# Altium project S7CAS-PLEIADES-CARTE-FILLE_P02.PrjPcb (part 1 of 2)
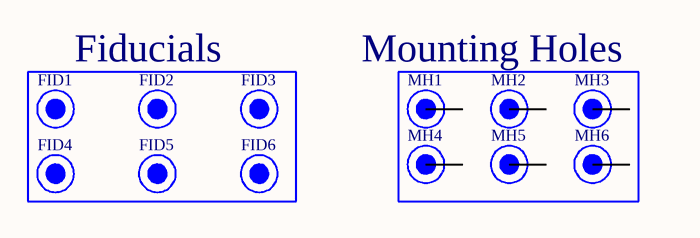
[diagram p0: S7CAS-PLEIADES-CARTE-FILLE_P02_TITLE_SHEET.SchDoc]
Project_Date: 2019-01-09; Project_DateCode: DC1234; Project_Designer1: Thomas Roy; Project_Designer2: Jean-Francois Bilodeau; Project_Designer3: Simon Milhomme; Project_Designer4: Emile Laplante; Project_Global: S7CAS-PLEIADES; Project_Group: CARTE-FILLE; Project_Name: CARTE-FILLE; Project_Revision: 1.000; Project_Stencil_Bot_Thickness: 0.1 MM; Project_Stencil_Top_Thickness: 0.1 MM
5 sheets, 168 parts. Net scope: flat (ports and power ports of the same name join across sheets).
Board file: S7CAS-PLEIADES-CARTE-FILLE_P02.PcbDoc
Sheets:
  S7CAS-PLEIADES-CARTE-FILLE_P02_TITLE_SHEET.SchDoc
  S7CAS-PLEIADES-CARTE-FILLE_P02_ALIMENTATION.SchDoc
  S7CAS-PLEIADES-CARTE-FILLE_P02_CONNECTEUR_FMC.SchDoc
  S7CAS-PLEIADES-CARTE-FILLE_P02_ADC.SchDoc
  S7CAS-PLEIADES-CARTE-FILLE_P02_DAC.SchDoc

## Sheet S7CAS-PLEIADES-CARTE-FILLE_P02_TITLE_SHEET.SchDoc
size Tabloid; DocumentNumber: 1; SheetNumber: 1; SheetTotal: 5; Size: 11x17; Sheet_Name: Sheet Description

### Parts
FID1  Fiducial 1mm  [FID_1MM]  (value not drawn)  (no BOM)
FID2  Fiducial 1mm  [FID_1MM]  (value not drawn)  (no BOM)
FID3  Fiducial 1mm  [FID_1MM]  (value not drawn)  (no BOM)
FID4  Fiducial 1mm  [FID_1MM]  (value not drawn)  (no BOM)
FID5  Fiducial 1mm  [FID_1MM]  (value not drawn)  (no BOM)
FID6  Fiducial 1mm  [FID_1MM]  (value not drawn)  (no BOM)
MH1  Mounting Hole 6-32  [MH_ENG_6-32]  (value not drawn)  (no BOM)
MH2  Mounting Hole 6-32  [MH_ENG_6-32]  (value not drawn)  (no BOM)
MH3  Mounting Hole 6-32  [MH_ENG_6-32]  (value not drawn)  (no BOM)
MH4  Mounting Hole 6-32  [MH_ENG_6-32]  (value not drawn)  (no BOM)
MH5  Mounting Hole 6-32  [MH_ENG_6-32]  (value not drawn)  (no BOM)
MH6  Mounting Hole 6-32  [MH_ENG_6-32]  (value not drawn)  (no BOM)

### Blocks framed on the sheet
Fiducials: FID1-FID6

### Nets

Not connected (* = marked no-connect by the designer): MH1 1; MH2 1; MH3 1; MH4 1; MH5 1; MH6 1

### Notes on the sheet
- Mounting Holes
- Revision history
- Package size conversion
- Metric
- 1005
- 1608
- Imperial
- 0402
- 0603
- Revision
- 2012
- 3216
- 0805
- 1206
- 3225
- 6432
- 1210
- 2512
- Date :
- Project Title
- Global Project
- Size
- Group
- Date
- Sheet
- of
- Filename
- Designers

### Library data of the parts
FID1-FID6 = FID_1MM: FID - 1MM; Current: *; Mfg Part Number: *; HelpURL: *; CreatedBy: Jonathan Bouchard; VerifiedBy: Alexandre Imbeault; FootprintNameOK: Jonathan Bouchard; Temperature: *; Power: *; Precision: *; Value: *; Mfg: *; Package: *; Voltage: *
MH1-MH6 = MH_6-32: MH - Mounting Hole 6-32; Current: *; Mfg Part Number: *; HelpURL: *; CreatedBy: Jonathan Bouchard; VerifiedBy: Alexandre Imbeault; FootprintNameOK: Jonathan Bouchard; Temperature: *; Power: *; Precision: *; Value: *; Mfg: *; Package: *; Voltage: *

## Sheet S7CAS-PLEIADES-CARTE-FILLE_P02_ALIMENTATION.SchDoc
size Tabloid; DocumentNumber: 2; SheetNumber: 2; SheetTotal: 5; Size: 11x17; Sheet_Name: ALIMENTATION
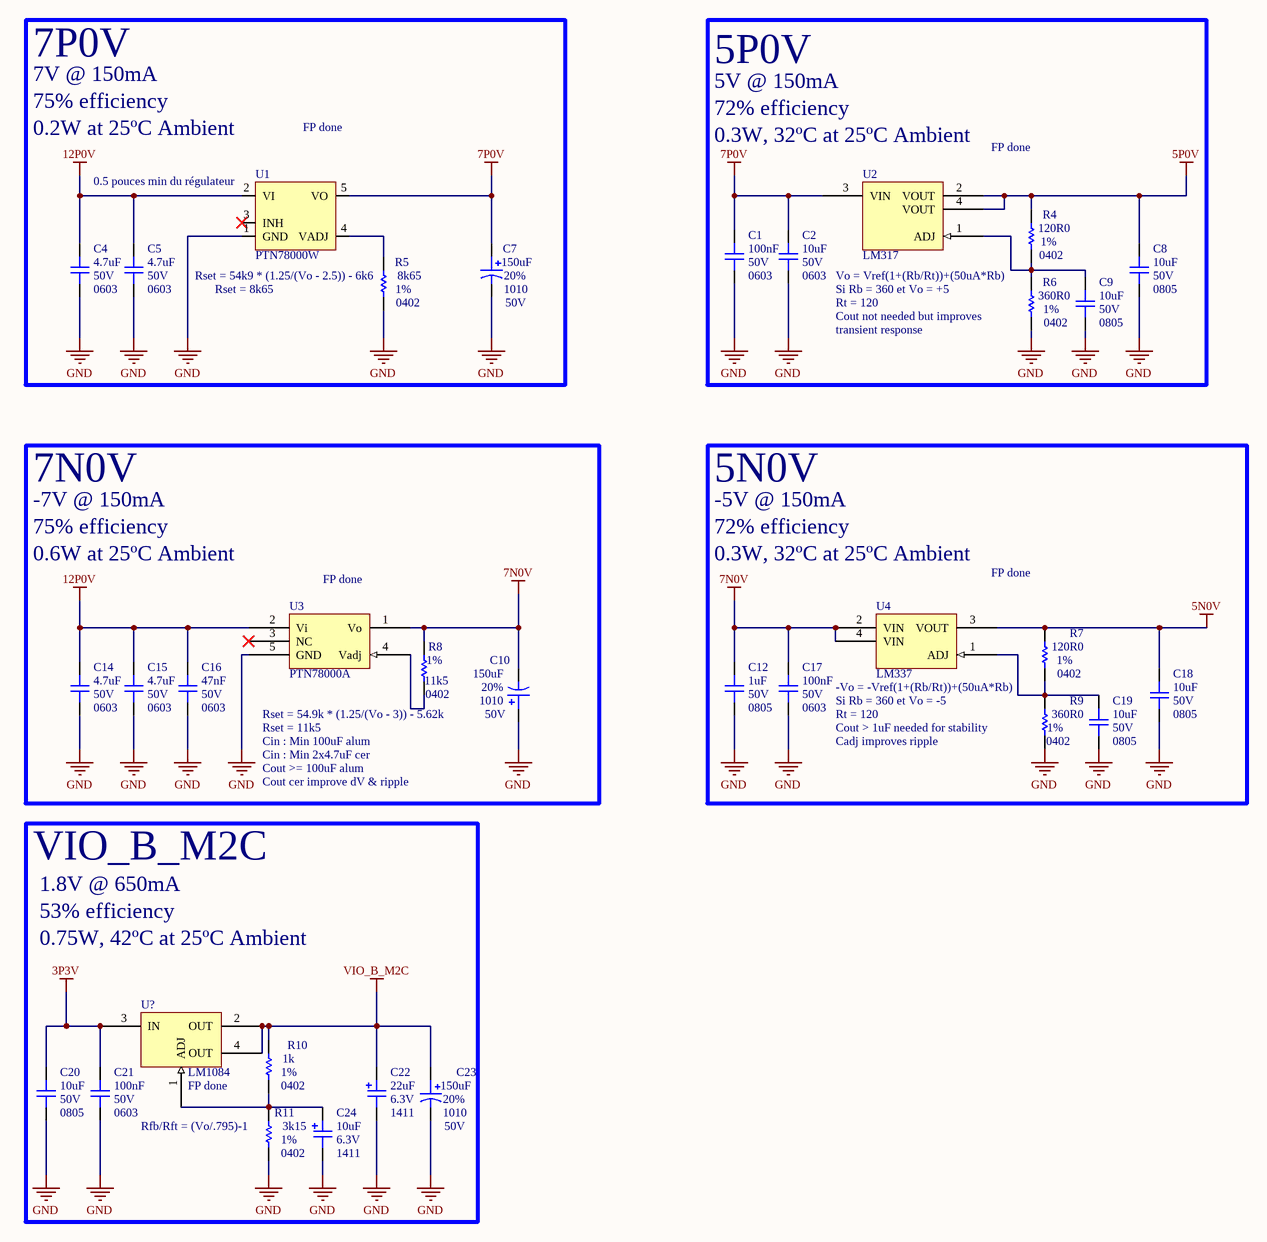
[diagram p1: S7CAS-PLEIADES-CARTE-FILLE_P02_ALIMENTATION.SchDoc]

### Parts
C1  value 100nF  Voltage: 50V  Package: 0603  [CAP_0603]  (hidden comment: CAP - 0603)
C2  value 10uF  Voltage: 50V  Package: 0603  [CAP_0603]  (hidden comment: CAP - 0603)
C4  value 4.7uF  Voltage: 50V  Package: 0603  [CAP_0603]  (hidden comment: CAP - 0603)
C5  value 4.7uF  Voltage: 50V  Package: 0603  [CAP_0603]  (hidden comment: CAP - 0603)
C7  value 150uF  Voltage: 50V  Package: 1010  Precision: 20%  [CAP_ALU_1010_vishay]  (hidden comment: MAL215099101E3)
C8  value 10uF  Voltage: 50V  Package: 0805  [CAP_0805]  (hidden comment: CAP - 0805)
C9  value 10uF  Voltage: 50V  Package: 0805  [CAP_0805]  (hidden comment: CAP - 0805)
C10  value 150uF  Voltage: 50V  Package: 1010  Precision: 20%  [CAP_ALU_1010_vishay]  (hidden comment: MAL215099101E3)
C12  value 1uF  Voltage: 50V  Package: 0805  [CAP_0805]  (hidden comment: CAP - 0805)
C14  value 4.7uF  Voltage: 50V  Package: 0603  [CAP_0603]  (hidden comment: CAP - 0603)
C15  value 4.7uF  Voltage: 50V  Package: 0603  [CAP_0603]  (hidden comment: CAP - 0603)
C16  value 47nF  Voltage: 50V  Package: 0603  [CAP_0603]  (hidden comment: CAP - 0603)
C17  value 100nF  Voltage: 50V  Package: 0603  [CAP_0603]  (hidden comment: CAP - 0603)
C18  value 10uF  Voltage: 50V  Package: 0805  [CAP_0805]  (hidden comment: CAP - 0805)
C19  value 10uF  Voltage: 50V  Package: 0805  [CAP_0805]  (hidden comment: CAP - 0805)
C20  value 10uF  Voltage: 50V  Package: 0805  [CAP_0805]  (hidden comment: CAP - 0805)
C21  value 100nF  Voltage: 50V  Package: 0603  [CAP_0603]  (hidden comment: CAP - 0603)
C22  value 22uF  Voltage: 6.3V  Package: 1411  [CAP_TAN_1411(B)]  (hidden comment: CAP - TANTALUM - CASE B)
C23  value 150uF  Voltage: 50V  Package: 1010  Precision: 20%  [CAP_ALU_1010_vishay]  (hidden comment: MAL215099101E3)
C24  value 10uF  Voltage: 6.3V  Package: 1411  [CAP_TAN_1411(B)]  (hidden comment: CAP - TANTALUM - CASE B)
R4  value 120R0  Package: 0402  Precision: 1%  [RES_0402]  (hidden comment: RES - 0402)
R5  value 8k65  Package: 0402  Precision: 1%  [RES_0402]  (hidden comment: RES - 0402)
R6  value 360R0  Package: 0402  Precision: 1%  [RES_0402]  (hidden comment: RES - 0402)
R7  value 120R0  Package: 0402  Precision: 1%  [RES_0402]  (hidden comment: RES - 0402)
R8  value 11k5  Package: 0402  Precision: 1%  [RES_0402]  (hidden comment: RES - 0402)
R9  value 360R0  Package: 0402  Precision: 1%  [RES_0402]  (hidden comment: RES - 0402)
R10  value 1k  Package: 0402  Precision: 1%  [RES_0402]  (hidden comment: RES - 0402)
R11  value 3k15  Package: 0402  Precision: 1%  [RES_0402]  (hidden comment: RES - 0402)
U1  PTN78000W  [PTN78000W]
U2  LM317  [LM317-DCY]
U3  PTN78000A  [PTN78000A]
U4  LM337  [LM337-DCY]
U?  LM1084  [LM1084-DPAK]

### Blocks framed on the sheet
7P0V: C4 C5 C7 R5 U1
5P0V: C1 C2 C8 C9 R4 R6 U2
7N0V: C10 C14-C16 R8 U3
5N0V: C12 C17-C19 R7 R9 U4
VIO_B_M2C: C20-C24 R10 R11 U?

### Nets
3P3V: C20.2 C21.2 U?.3(IN)
5N0V: C18.2 R7.2 U4.3(VOUT)
5P0V: C8.2 R4.2 U2.2(VOUT) U2.4(VOUT)
7N0V: C10.2 C12.2 C17.2 R8.1 U3.1(Vo) U4.2(VIN) U4.4(VIN)
7P0V: C1.2 C2.2 C7.1 U1.5(VO) U2.3(VIN)
12P0V: C4.2 C5.2 C14.2 C15.2 C16.2 U1.2(VI) U3.2(Vi)
GND: C1.1 C2.1 C4.1 C5.1 C7.2 C8.1 C9.1 C10.1 C12.1 C14.1 C15.1 C16.1 C17.1 C18.1 C19.1 C20.1 C21.1 C22.1 C23.2 C24.1 R5.1 R6.1 R9.1 R11.1 U1.1(GND) U3.5(GND)
VIO_B_M2C: C22.2 C23.1 R10.2 U?.2(OUT) U?.4(OUT)
NetC9_2: C9.2 R4.1 R6.2 U2.1(ADJ)
NetC19_2: C19.2 R7.1 R9.2 U4.1(ADJ)
NetC24_2: C24.2 R10.1 R11.2 U?.1(ADJ)
NetR5_2: R5.2 U1.4(VADJ)
NetR8_2: R8.2 U3.4(Vadj)

Not connected (* = marked no-connect by the designer): U1 3(INH)*; U3 3(NC)*

### Notes on the sheet
- 7V @ 150mA
- 75% efficiency
- 0.2W at 25ºC Ambient
- FP done
- 5V @ 150mA
- 72% efficiency
- (near U2) 0.3W, 32ºC at 25ºC Ambient
- (near U1) 0.5 pouces min du régulateur
- (near R5) Rset = 54k9 * (1.25/(Vo - 2.5)) - 6k6
- Vo = Vref(1+(Rb/Rt))+(50uA*Rb)
- (near U1) Rset = 8k65
- Si Rb = 360 et Vo = +5
- Rt = 120
- (near R6) Cout not needed but improves
- transient response
- -7V @ 150mA
- -5V @ 150mA
- 0.6W at 25ºC Ambient
- (near U3) FP done
- 0.3W, 32ºC at 25ºC Ambient
- Rset = 54.9k * (1.25/(Vo - 3)) - 5.62k
- Rset = 11k5
- Cin : Min 100uF alum
- -Vo = -Vref(1+(Rb/Rt))+(50uA*Rb)
- Si Rb = 360 et Vo = -5
- (near R9) Cout > 1uF needed for stability
- Cadj improves ripple
- Cin : Min 2x4.7uF cer
- Cout cer improve dV & ripple
- Cout >= 100uF alum
- 1.8V @ 650mA
- 53% efficiency
- 0.75W, 42ºC at 25ºC Ambient
- (near U?) FP done
- (near R11) Rfb/Rft = (Vo/.795)-1
- Sheet Name
- Project Title
- Global Project
- Size
- Group
- Revision
- Date
- Sheet
- of
- Filename
- Designers

### Library data of the parts
C1 C2 C4 C5 C14-C17 C21 = CAP - 0603: Precision: 10%; Current: *; CreatedBy: Jonathan Bouchard; Power: *
C7 C10 C23 = CAP_ALU_MAL215099101E3: CAP - ALU 100uF 20% 50V - 1010; Current: 490mA; Mfg: Vishay Dale; Mfg Part Number: MAL215099101E3; HelpURL: http://www.vishay.com/docs/28395/150crz.pdf; CreatedBy: Jonathan Bouchard; Temperature: -55°C to 125°C; Power: *; Supplier 1: Digikey; Supplier Part Number 1: 4399PHDKR-ND
C8 C9 C12 C18-C20 = CAP - 0805: Precision: 10%; Current: *; CreatedBy: Jonathan Bouchard; Power: *
C22 C24 = CAP_TANT_1411(B): CAP - TANTALUM - 1411; Precision: 10%; Current: *; CreatedBy: Jonathan Bouchard; Power: *
R4 R6-R11 = RES - 0402: Voltage: 50V; Power: 1/16W; Current: *; CreatedBy: Jonathan Bouchard
R5 = RES - 0402: RES - 0402 - 1/16W; Voltage: 50V; Current: *; CreatedBy: Jonathan Bouchard; Power: 1/16W
U1 = PTN78000H: XXX - 1.5-A, / WIDE-INPUT / ADJUSTABLE / SWITCHING / REGULATOR - Package; GRAMS Lib Spec: 2.7

## Sheet S7CAS-PLEIADES-CARTE-FILLE_P02_CONNECTEUR_FMC.SchDoc
size Tabloid; DocumentNumber: 3; SheetNumber: 3; SheetTotal: 5; Size: 11x17; Sheet_Name: CONNECTEUR FMC
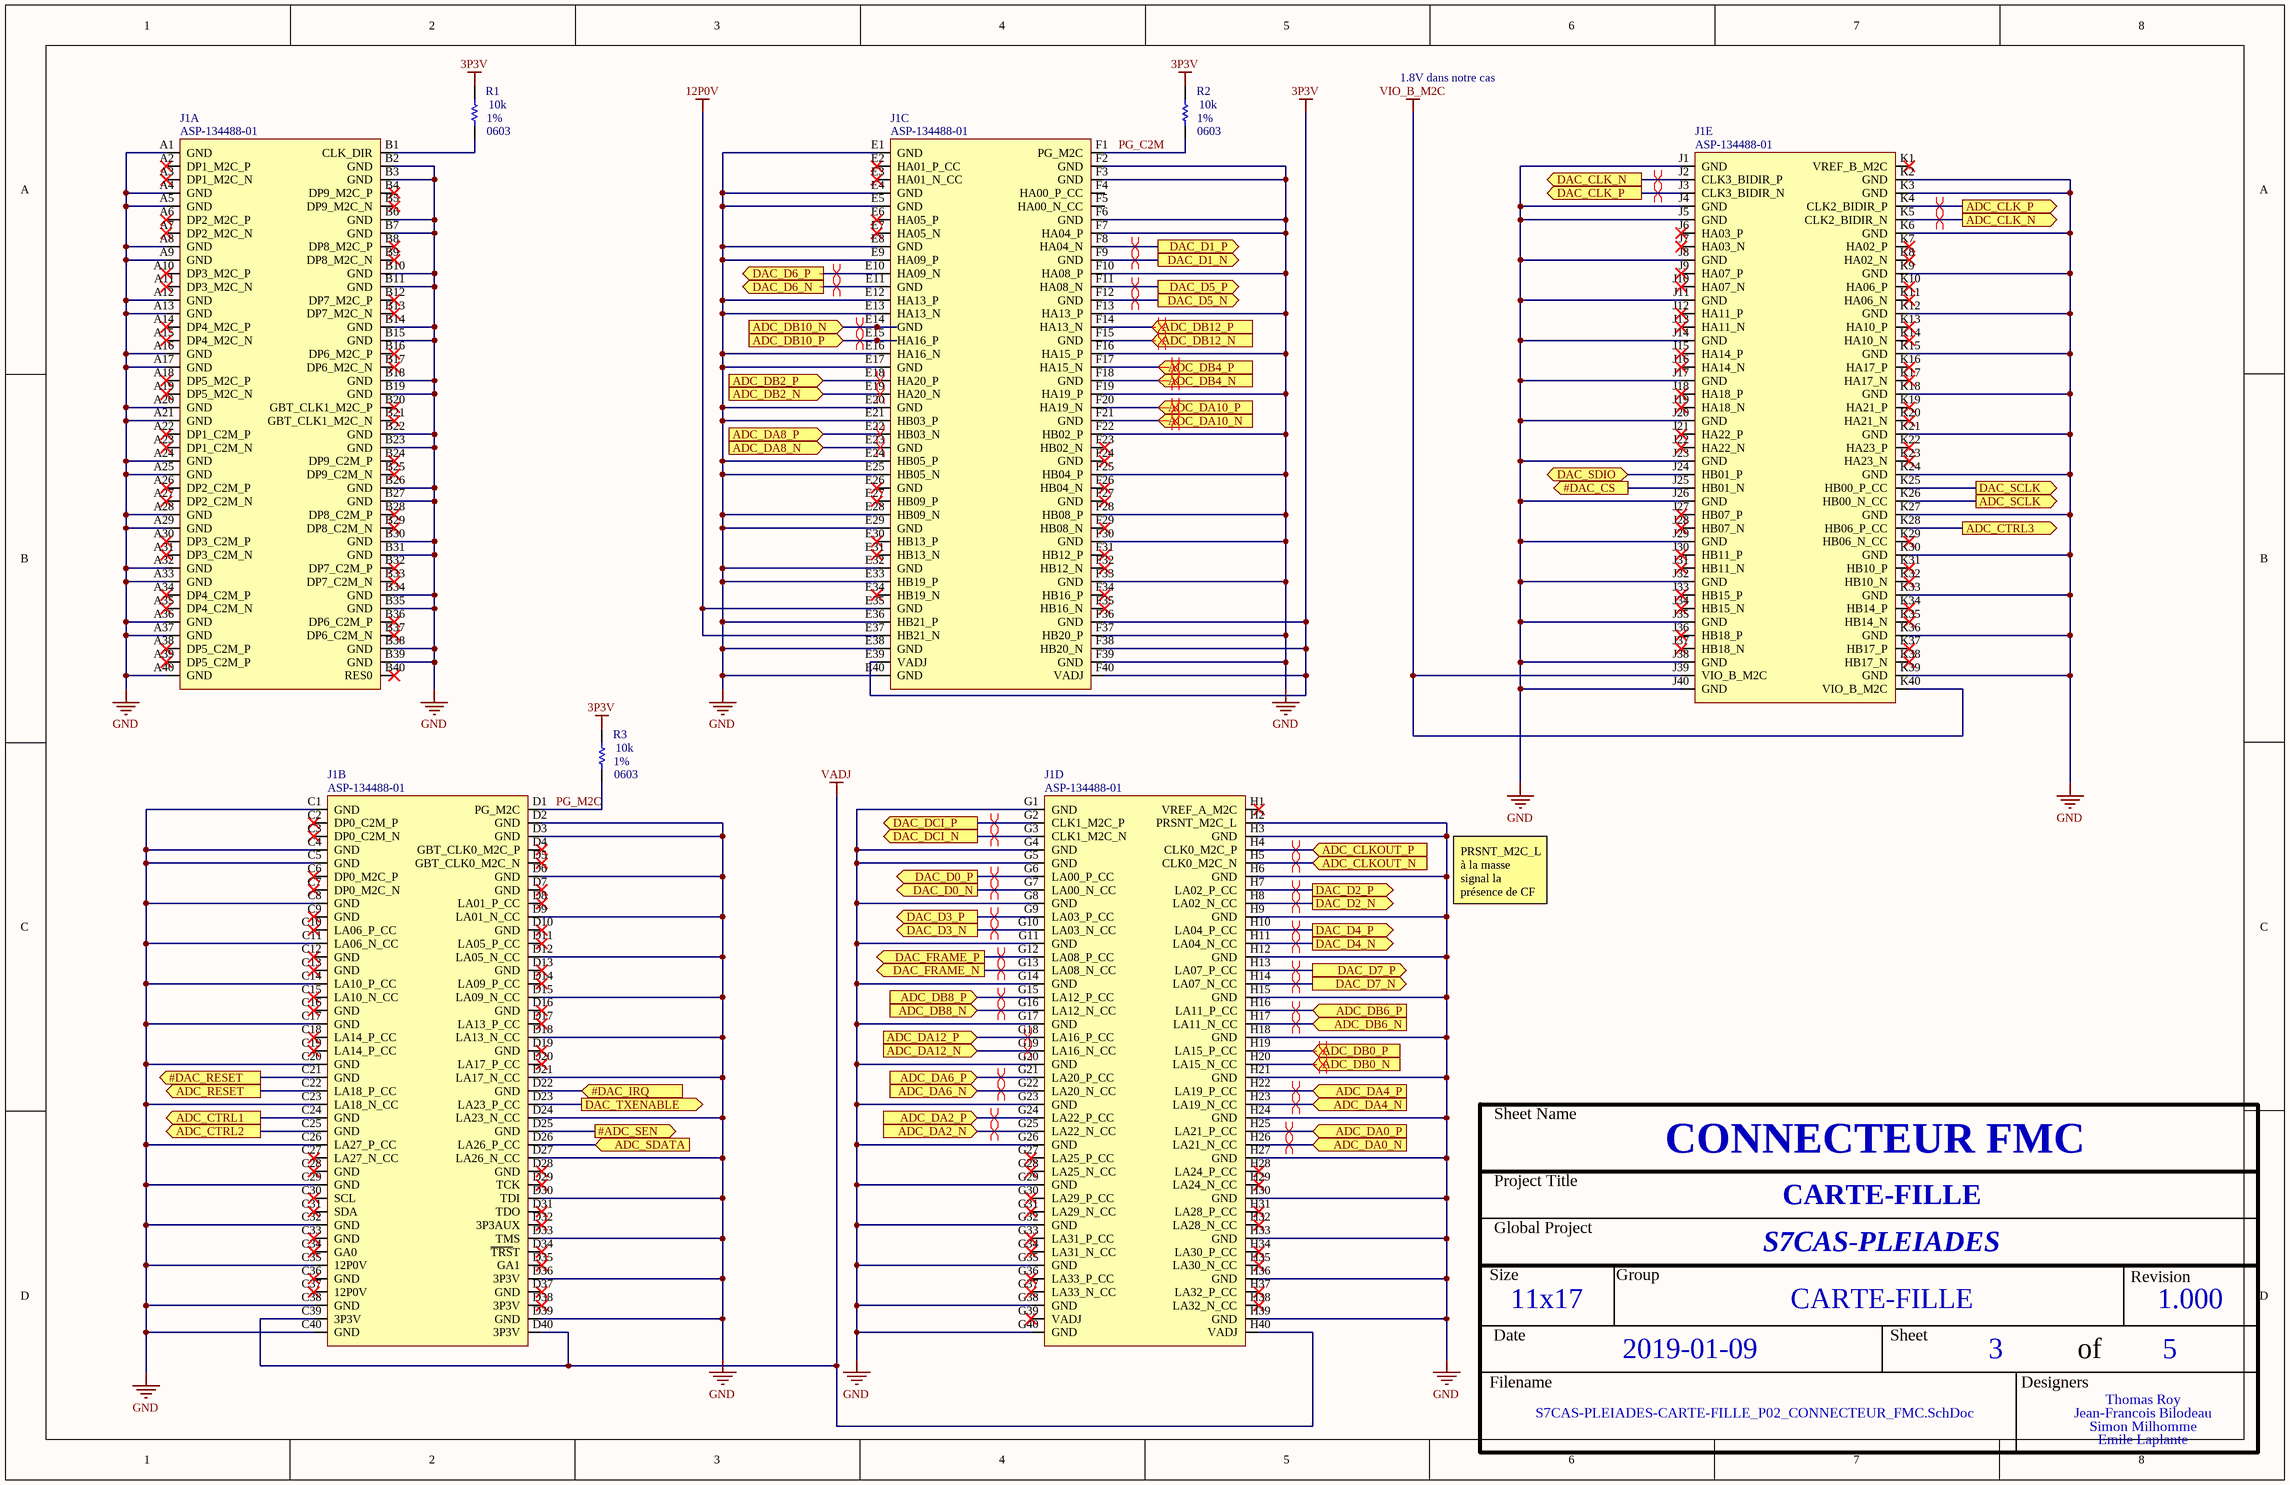
[diagram p2: S7CAS-PLEIADES-CARTE-FILLE_P02_CONNECTEUR_FMC.SchDoc]

### Parts
J1  ASP-134488-01  [CONN_SAMTEC_ASP-134488-01]  (parts A,B,C,D,E of 5)
R1  value 10k  Package: 0603  Precision: 1%  [RES_0603]  (hidden comment: RES - 0603)
R2  value 10k  Package: 0603  Precision: 1%  [RES_0603]  (hidden comment: RES - 0603)
R3  value 10k  Package: 0603  Precision: 1%  [RES_0603]  (hidden comment: RES - 0603)

### Ports
#ADC_SEN (out), #DAC_CS (out), #DAC_IRQ (in), #DAC_RESET (out), ADC_CLK_N (out), ADC_CLK_P (out), ADC_CLKOUT_N (in), ADC_CLKOUT_P (in), ADC_CTRL1 (out), ADC_CTRL2 (out), ADC_CTRL3 (out), ADC_DA0_N (in), ADC_DA0_P (in), ADC_DA2_N (in), ADC_DA2_P (in), ADC_DA4_N (in), ADC_DA4_P (in), ADC_DA6_N (in), ADC_DA6_P (in), ADC_DA8_N (in), ADC_DA8_P (in), ADC_DA10_N (in), ADC_DA10_P (in), ADC_DA12_N (in), ADC_DA12_P (in), ADC_DB0_N (in), ADC_DB0_P (in), ADC_DB2_N (in), ADC_DB2_P (in), ADC_DB4_N (in), ADC_DB4_P (in), ADC_DB6_N (in), ADC_DB6_P (in), ADC_DB8_N (in), ADC_DB8_P (in), ADC_DB10_N (in), ADC_DB10_P (in), ADC_DB12_N (in), ADC_DB12_P (in), ADC_RESET (out), ADC_SCLK (out), ADC_SDATA (in), DAC_CLK_N (out), DAC_CLK_P (out), DAC_D0_N (out), DAC_D0_P (out), DAC_D1_N (out), DAC_D1_P (out), DAC_D2_N (out), DAC_D2_P (out), DAC_D3_N (out), DAC_D3_P (out), DAC_D4_N (out), DAC_D4_P (out), DAC_D5_N (out), DAC_D5_P (out), DAC_D6_N (out), DAC_D6_P (out), DAC_D7_N (out), DAC_D7_P (out), DAC_DCI_N (out), DAC_DCI_P (out), DAC_FRAME_N (out), DAC_FRAME_P (out), DAC_SCLK (out), DAC_SDIO (bidir), DAC_TXENABLE (out)

### Nets
3P3V: J1.E39(VADJ) J1.F36(GND) J1.F38(HB20_N) J1.F40(VADJ) R1.2 R2.2 R3.2
12P0V: J1.E35(GND) J1.E37(HB21_N)
GND: J1.A1(GND) J1.A4(GND) J1.A5(GND) J1.A8(GND) J1.A9(GND) J1.A12(GND) J1.A13(GND) J1.A16(GND) J1.A17(GND) J1.A20(GND) J1.A21(GND) J1.A24(GND) J1.A25(GND) J1.A28(GND) J1.A29(GND) J1.A32(GND) J1.A33(GND) J1.A36(GND) J1.A37(GND) J1.A40(GND) J1.B2(GND) J1.B3(GND) J1.B6(GND) J1.B7(GND) J1.B10(GND) J1.B11(GND) J1.B14(GND) J1.B15(GND) J1.B18(GND) J1.B19(GND) J1.B22(GND) J1.B23(GND) J1.B26(GND) J1.B27(GND) J1.B30(GND) J1.B31(GND) J1.B34(GND) J1.B35(GND) J1.B38(GND) J1.B39(GND) J1.C1(GND) J1.C4(GND) J1.C5(GND) J1.C8(GND) J1.C11(LA06_N_CC) J1.C14(LA10_P_CC) J1.C17(GND) J1.C20(GND) J1.C23(LA18_N_CC) J1.C26(LA27_P_CC) J1.C29(GND) J1.C32(GND) J1.C35(12P0V) J1.C38(GND) J1.C40(GND) J1.D2(GND) J1.D3(GND) J1.D6(GND) J1.D9(LA01_N_CC) J1.D12(LA05_N_CC) J1.D15(LA09_N_CC) J1.D18(LA13_N_CC) J1.D21(LA17_N_CC) J1.D24(LA23_N_CC) J1.D27(LA26_N_CC) J1.D30(TDI) J1.D33(TMS) J1.D36(3P3V) J1.D39(GND) J1.E1(GND) J1.E4(GND) J1.E5(GND) J1.E8(GND) J1.E9(HA09_P) J1.E12(HA13_P) J1.E13(HA13_N) J1.E16(HA16_N) J1.E17(GND) J1.E20(GND) J1.E21(HB03_P) J1.E24(HB05_P) J1.E25(HB05_N) J1.E28(HB09_N) J1.E29(GND) J1.E32(GND) J1.E33(HB19_P) J1.E36(HB21_P) J1.E38(GND) J1.E40(GND) J1.F2(GND) J1.F3(GND) J1.F6(GND) J1.F7(HA04_P) J1.F10(HA08_P) J1.F13(HA13_P) J1.F16(HA15_P) J1.F19(HA19_P) J1.F22(HB02_P) J1.F25(HB04_P) J1.F28(HB08_P) J1.F30(GND) J1.F33(GND) J1.F37(HB20_P) J1.F39(GND) J1.G1(GND) J1.G4(GND) J1.G5(GND) J1.G8(GND) J1.G11(GND) J1.G14(GND) J1.G17(GND) J1.G20(GND) J1.G23(GND) J1.G26(GND) J1.G29(GND) J1.G32(GND) J1.G35(GND) J1.G38(GND) J1.G40(GND) J1.H2(PRSNT_M2C_L) J1.H3(GND) J1.H6(GND) J1.H9(GND) J1.H12(GND) J1.H15(GND) J1.H18(GND) J1.H21(GND) J1.H24(GND) J1.H27(GND) J1.H30(GND) J1.H33(GND) J1.H36(GND) J1.H39(GND) J1.J1(GND) J1.J4(GND) J1.J5(GND) J1.J8(GND) J1.J11(GND) J1.J14(GND) J1.J17(GND) J1.J20(GND) J1.J23(GND) J1.J26(GND) J1.J29(GND) J1.J32(GND) J1.J35(GND) J1.J38(GND) J1.J40(GND) J1.K2(GND) J1.K3(GND) J1.K6(GND) J1.K9(GND) J1.K12(GND) J1.K15(GND) J1.K18(GND) J1.K21(GND) J1.K24(GND) J1.K27(GND) J1.K30(GND) J1.K33(GND) J1.K36(GND) J1.K39(GND)
VADJ: J1.C39(3P3V) J1.D40(3P3V) J1.H40(VADJ)
VIO_B_M2C: J1.J39(VIO_B_M2C) J1.K40(VIO_B_M2C)
#ADC_SEN: J1.D25(GND) ; port #ADC_SEN
#DAC_CS: J1.J25(HB01_N) ; port #DAC_CS
#DAC_IRQ: J1.D22(GND) ; port #DAC_IRQ
#DAC_RESET: J1.C21(GND) ; port #DAC_RESET
ADC_CLK_N: J1.K5(CLK2_BIDIR_N) ; port ADC_CLK_N
ADC_CLK_P: J1.K4(CLK2_BIDIR_P) ; port ADC_CLK_P
ADC_CLKOUT_N: J1.H5(CLK0_M2C_N) ; port ADC_CLKOUT_N
ADC_CLKOUT_P: J1.H4(CLK0_M2C_P) ; port ADC_CLKOUT_P
ADC_CTRL1: J1.C24(GND) ; port ADC_CTRL1
ADC_CTRL2: J1.C25(GND) ; port ADC_CTRL2
ADC_CTRL3: J1.K28(HB06_P_CC) ; port ADC_CTRL3
ADC_DA0_N: J1.H26(LA21_N_CC) ; port ADC_DA0_N
ADC_DA0_P: J1.H25(LA21_P_CC) ; port ADC_DA0_P
ADC_DA2_N: J1.G25(LA22_N_CC) ; port ADC_DA2_N
ADC_DA2_P: J1.G24(LA22_P_CC) ; port ADC_DA2_P
ADC_DA4_N: J1.H23(LA19_N_CC) ; port ADC_DA4_N
ADC_DA4_P: J1.H22(LA19_P_CC) ; port ADC_DA4_P
ADC_DA6_N: J1.G22(LA20_N_CC) ; port ADC_DA6_N
ADC_DA6_P: J1.G21(LA20_P_CC) ; port ADC_DA6_P
ADC_DA8_N: J1.E23(GND) ; port ADC_DA8_N
ADC_DA8_P: J1.E22(HB03_N) ; port ADC_DA8_P
ADC_DA10_N: J1.F21(GND) ; port ADC_DA10_N
ADC_DA10_P: J1.F20(HA19_N) ; port ADC_DA10_P
ADC_DA12_N: J1.G19(LA16_N_CC) ; port ADC_DA12_N
ADC_DA12_P: J1.G18(LA16_P_CC) ; port ADC_DA12_P
ADC_DB0_N: J1.H20(LA15_N_CC) ; port ADC_DB0_N
ADC_DB0_P: J1.H19(LA15_P_CC) ; port ADC_DB0_P
ADC_DB2_N: J1.E19(HA20_N) ; port ADC_DB2_N
ADC_DB2_P: J1.E18(HA20_P) ; port ADC_DB2_P
ADC_DB4_N: J1.F18(GND) ; port ADC_DB4_N
ADC_DB4_P: J1.F17(HA15_N) ; port ADC_DB4_P
ADC_DB6_N: J1.H17(LA11_N_CC) ; port ADC_DB6_N
ADC_DB6_P: J1.H16(LA11_P_CC) ; port ADC_DB6_P
ADC_DB8_N: J1.G16(LA12_N_CC) ; port ADC_DB8_N
ADC_DB8_P: J1.G15(LA12_P_CC) ; port ADC_DB8_P
ADC_DB10_N: J1.E14(GND) ; port ADC_DB10_N
ADC_DB10_P: J1.E15(HA16_P) ; port ADC_DB10_P
ADC_DB12_N: J1.F15(GND) ; port ADC_DB12_N
ADC_DB12_P: J1.F14(HA13_N) ; port ADC_DB12_P
ADC_RESET: J1.C22(LA18_P_CC) ; port ADC_RESET
ADC_SCLK: J1.K26(HB00_N_CC) ; port ADC_SCLK
ADC_SDATA: J1.D26(LA26_P_CC) ; port ADC_SDATA
DAC_CLK_N: J1.J2(CLK3_BIDIR_P) ; port DAC_CLK_N
DAC_CLK_P: J1.J3(CLK3_BIDIR_N) ; port DAC_CLK_P
DAC_D0_N: J1.G7(LA00_N_CC) ; port DAC_D0_N
DAC_D0_P: J1.G6(LA00_P_CC) ; port DAC_D0_P
DAC_D1_N: J1.F9(GND) ; port DAC_D1_N
DAC_D1_P: J1.F8(HA04_N) ; port DAC_D1_P
DAC_D2_N: J1.H8(LA02_N_CC) ; port DAC_D2_N
DAC_D2_P: J1.H7(LA02_P_CC) ; port DAC_D2_P
DAC_D3_N: J1.G10(LA03_N_CC) ; port DAC_D3_N
DAC_D3_P: J1.G9(LA03_P_CC) ; port DAC_D3_P
DAC_D4_N: J1.H11(LA04_N_CC) ; port DAC_D4_N
DAC_D4_P: J1.H10(LA04_P_CC) ; port DAC_D4_P
DAC_D5_N: J1.F12(GND) ; port DAC_D5_N
DAC_D5_P: J1.F11(HA08_N) ; port DAC_D5_P
DAC_D6_N: J1.E11(GND) ; port DAC_D6_N
DAC_D6_P: J1.E10(HA09_N) ; port DAC_D6_P
DAC_D7_N: J1.H14(LA07_N_CC) ; port DAC_D7_N
DAC_D7_P: J1.H13(LA07_P_CC) ; port DAC_D7_P
DAC_DCI_N: J1.G3(CLK1_M2C_N) ; port DAC_DCI_N
DAC_DCI_P: J1.G2(CLK1_M2C_P) ; port DAC_DCI_P
DAC_FRAME_N: J1.G13(LA08_N_CC) ; port DAC_FRAME_N
DAC_FRAME_P: J1.G12(LA08_P_CC) ; port DAC_FRAME_P
DAC_SCLK: J1.K25(HB00_P_CC) ; port DAC_SCLK
DAC_SDIO: J1.J24(HB01_P) ; port DAC_SDIO
DAC_TXENABLE: J1.D23(LA23_P_CC) ; port DAC_TXENABLE
PG_C2M: J1.F1(PG_M2C) R2.1
PG_M2C: J1.D1(PG_M2C) R3.1
NetJ1_B1: J1.B1(CLK_DIR) R1.1

Not connected (* = marked no-connect by the designer): J1 A2(DP1_M2C_P)* A3(DP1_M2C_N)* A6(DP2_M2C_P)* A7(DP2_M2C_N)* A10(DP3_M2C_P)* A11(DP3_M2C_N)* A14(DP4_M2C_P)* A15(DP4_M2C_N)* A18(DP5_M2C_P)* A19(DP5_M2C_N)* A22(DP1_C2M_P)* A23(DP1_C2M_N)* A26(DP2_C2M_P)* A27(DP2_C2M_N)* A30(DP3_C2M_P)* A31(DP3_C2M_N)* A34(DP4_C2M_P)* A35(DP4_C2M_N)* A38(DP5_C2M_P)* A39(DP5_C2M_P)* B4(DP9_M2C_P)* B5(DP9_M2C_N)* B8(DP8_M2C_P)* B9(DP8_M2C_N)* B12(DP7_M2C_P)* B13(DP7_M2C_N)* B16(DP6_M2C_P)* B17(DP6_M2C_N)* B20(GBT_CLK1_M2C_P)* B21(GBT_CLK1_M2C_N)* B24(DP9_C2M_P)* B25(DP9_C2M_N)* B28(DP8_C2M_P)* B29(DP8_C2M_N)* B32(DP7_C2M_P)* B33(DP7_C2M_N)* B36(DP6_C2M_P)* B37(DP6_C2M_N)* B40(RES0)* C2(DP0_C2M_P)* C3(DP0_C2M_N)* C6(DP0_M2C_P)* C7(DP0_M2C_N)* C9(GND)* C10(LA06_P_CC)* C12(GND)* C13(GND)* C15(LA10_N_CC)* C16(GND)* C18(LA14_P_CC)* C19(LA14_P_CC)* C27(LA27_N_CC)* C28(GND)* C30(SCL)* C31(SDA)* C33(GND)* C34(GA0)* C36(GND)* C37(12P0V)* D4(GBT_CLK0_M2C_P)* D5(GBT_CLK0_M2C_N)* D7(GND)* D8(LA01_P_CC)* D10(GND)* D11(LA05_P_CC)* D13(GND)* D14(LA09_P_CC)* D16(GND)* D17(LA13_P_CC)* D19(GND)* D20(LA17_P_CC)* D28(GND)* D29(TCK)* D31(TDO)* D32(3P3AUX)* D34(~{TRS}T)* D35(GA1)* D37(GND)* D38(3P3V)* E2(HA01_P_CC)* E3(HA01_N_CC)* E6(HA05_P)* E7(HA05_N)* E26(GND)* E27(HB09_P)* E30(HB13_P)* E31(HB13_N)* E34(HB19_N)* F4(HA00_P_CC) F5(HA00_N_CC) F23(HB02_N)* F24(GND)* F26(HB04_N)* F27(GND)* F29(HB08_N)* F31(HB12_P)* F32(HB12_N)* F34(HB16_P)* F35(HB16_N)* G27(LA25_P_CC)* G28(LA25_N_CC)* G30(LA29_P_CC)* G31(LA29_N_CC)* G33(LA31_P_CC)* G34(LA31_N_CC)* G36(LA33_P_CC)* G37(LA33_N_CC)* G39(VADJ)* H1(VREF_A_M2C)* H28(LA24_P_CC)* H29(LA24_N_CC)* H31(LA28_P_CC)* H32(LA28_N_CC)* H34(LA30_P_CC)* H35(LA30_N_CC)* H37(LA32_P_CC)* H38(LA32_N_CC)* J6(HA03_P)* J7(HA03_N)* J9(HA07_P)* J10(HA07_N)* J12(HA11_P)* J13(HA11_N)* J15(HA14_P)* J16(HA14_N)* J18(HA18_P)* J19(HA18_N)* J21(HA22_P)* J22(HA22_N)* J27(HB07_P)* J28(HB07_N)* J30(HB11_P)* J31(HB11_N)* J33(HB15_P)* J34(HB15_N)* J36(HB18_P)* J37(HB18_N)* K1(VREF_B_M2C)* K7(HA02_P)* K8(HA02_N)* K10(HA06_P)* K11(HA06_N)* K13(HA10_P)* K14(HA10_N)* K16(HA17_P)* K17(HA17_N)* K19(HA21_P)* K20(HA21_N)* K22(HA23_P)* K23(HA23_N)* K29(HB06_N_CC)* K31(HB10_P)* K32(HB10_N)* K34(HB14_P)* K35(HB14_N)* K37(HB17_P)* K38(HB17_N)*

### Layout directives
differential pair; differential pair class DAC_DIF: (no net found under the mark), DAC_CLK_N, DAC_CLK_P, DAC_D0_N, DAC_D0_P, DAC_D1_N, DAC_D1_P, DAC_D2_N, DAC_D2_P, DAC_D3_N, DAC_D3_P, DAC_D4_N, DAC_D4_P, DAC_D5_N, DAC_D5_P, DAC_D7_N, DAC_D7_P, DAC_DCI_N, DAC_DCI_P, DAC_FRAME_N, DAC_FRAME_P
differential pair; differential pair class ADC_DIF: ADC_CLK_N, ADC_CLK_P, ADC_CLKOUT_N, ADC_CLKOUT_P, ADC_DA0_N, ADC_DA0_P, ADC_DA2_N, ADC_DA2_P, ADC_DA4_N, ADC_DA4_P, ADC_DA6_N, ADC_DA6_P, ADC_DA8_N, ADC_DA8_P, ADC_DA10_N, ADC_DA10_P, ADC_DA12_N, ADC_DA12_P, ADC_DB0_N, ADC_DB0_P, ADC_DB2_N, ADC_DB2_P, ADC_DB4_N, ADC_DB4_P, ADC_DB6_N, ADC_DB6_P, ADC_DB8_N, ADC_DB8_P, ADC_DB10_N, ADC_DB10_P, ADC_DB12_N, ADC_DB12_P

### Notes on the sheet
- 1.8V dans notre cas
- PRSNT_M2C_L à la masse signal la présence de CF à CM
- Sheet Name
- Project Title
- Global Project
- Size
- Group
- Revision
- Date
- Sheet
- of
- Filename
- Designers

### Library data of the parts
J1 = CONN_SAMTEC_ASP-134488-01: CONN - VITA 57 MEZZ MALE (DAUGHTERBOARD) HIGH DENSITY - SMD-400; Voltage: 240VAC; Current: 1.8A; Mfg: Samtec; Power: *; Mfg Part Number: ASP-134488-01; HelpURL: http://suddendocs.samtec.com/prints/asp-134488-01-mkt.pdf; CreatedBy: Jonathan Bouchard; Temperature: -55 °C to +125 °C; Value: *; Precision: *; Package: SMD-400
R1-R3 = RES - 0603: Current: *; CreatedBy: Jonathan Bouchard

## Sheet S7CAS-PLEIADES-CARTE-FILLE_P02_ADC.SchDoc
size Tabloid; DocumentNumber: 4; SheetNumber: 4; SheetTotal: 5; Sheet_Name: ADC; Size: 11x17
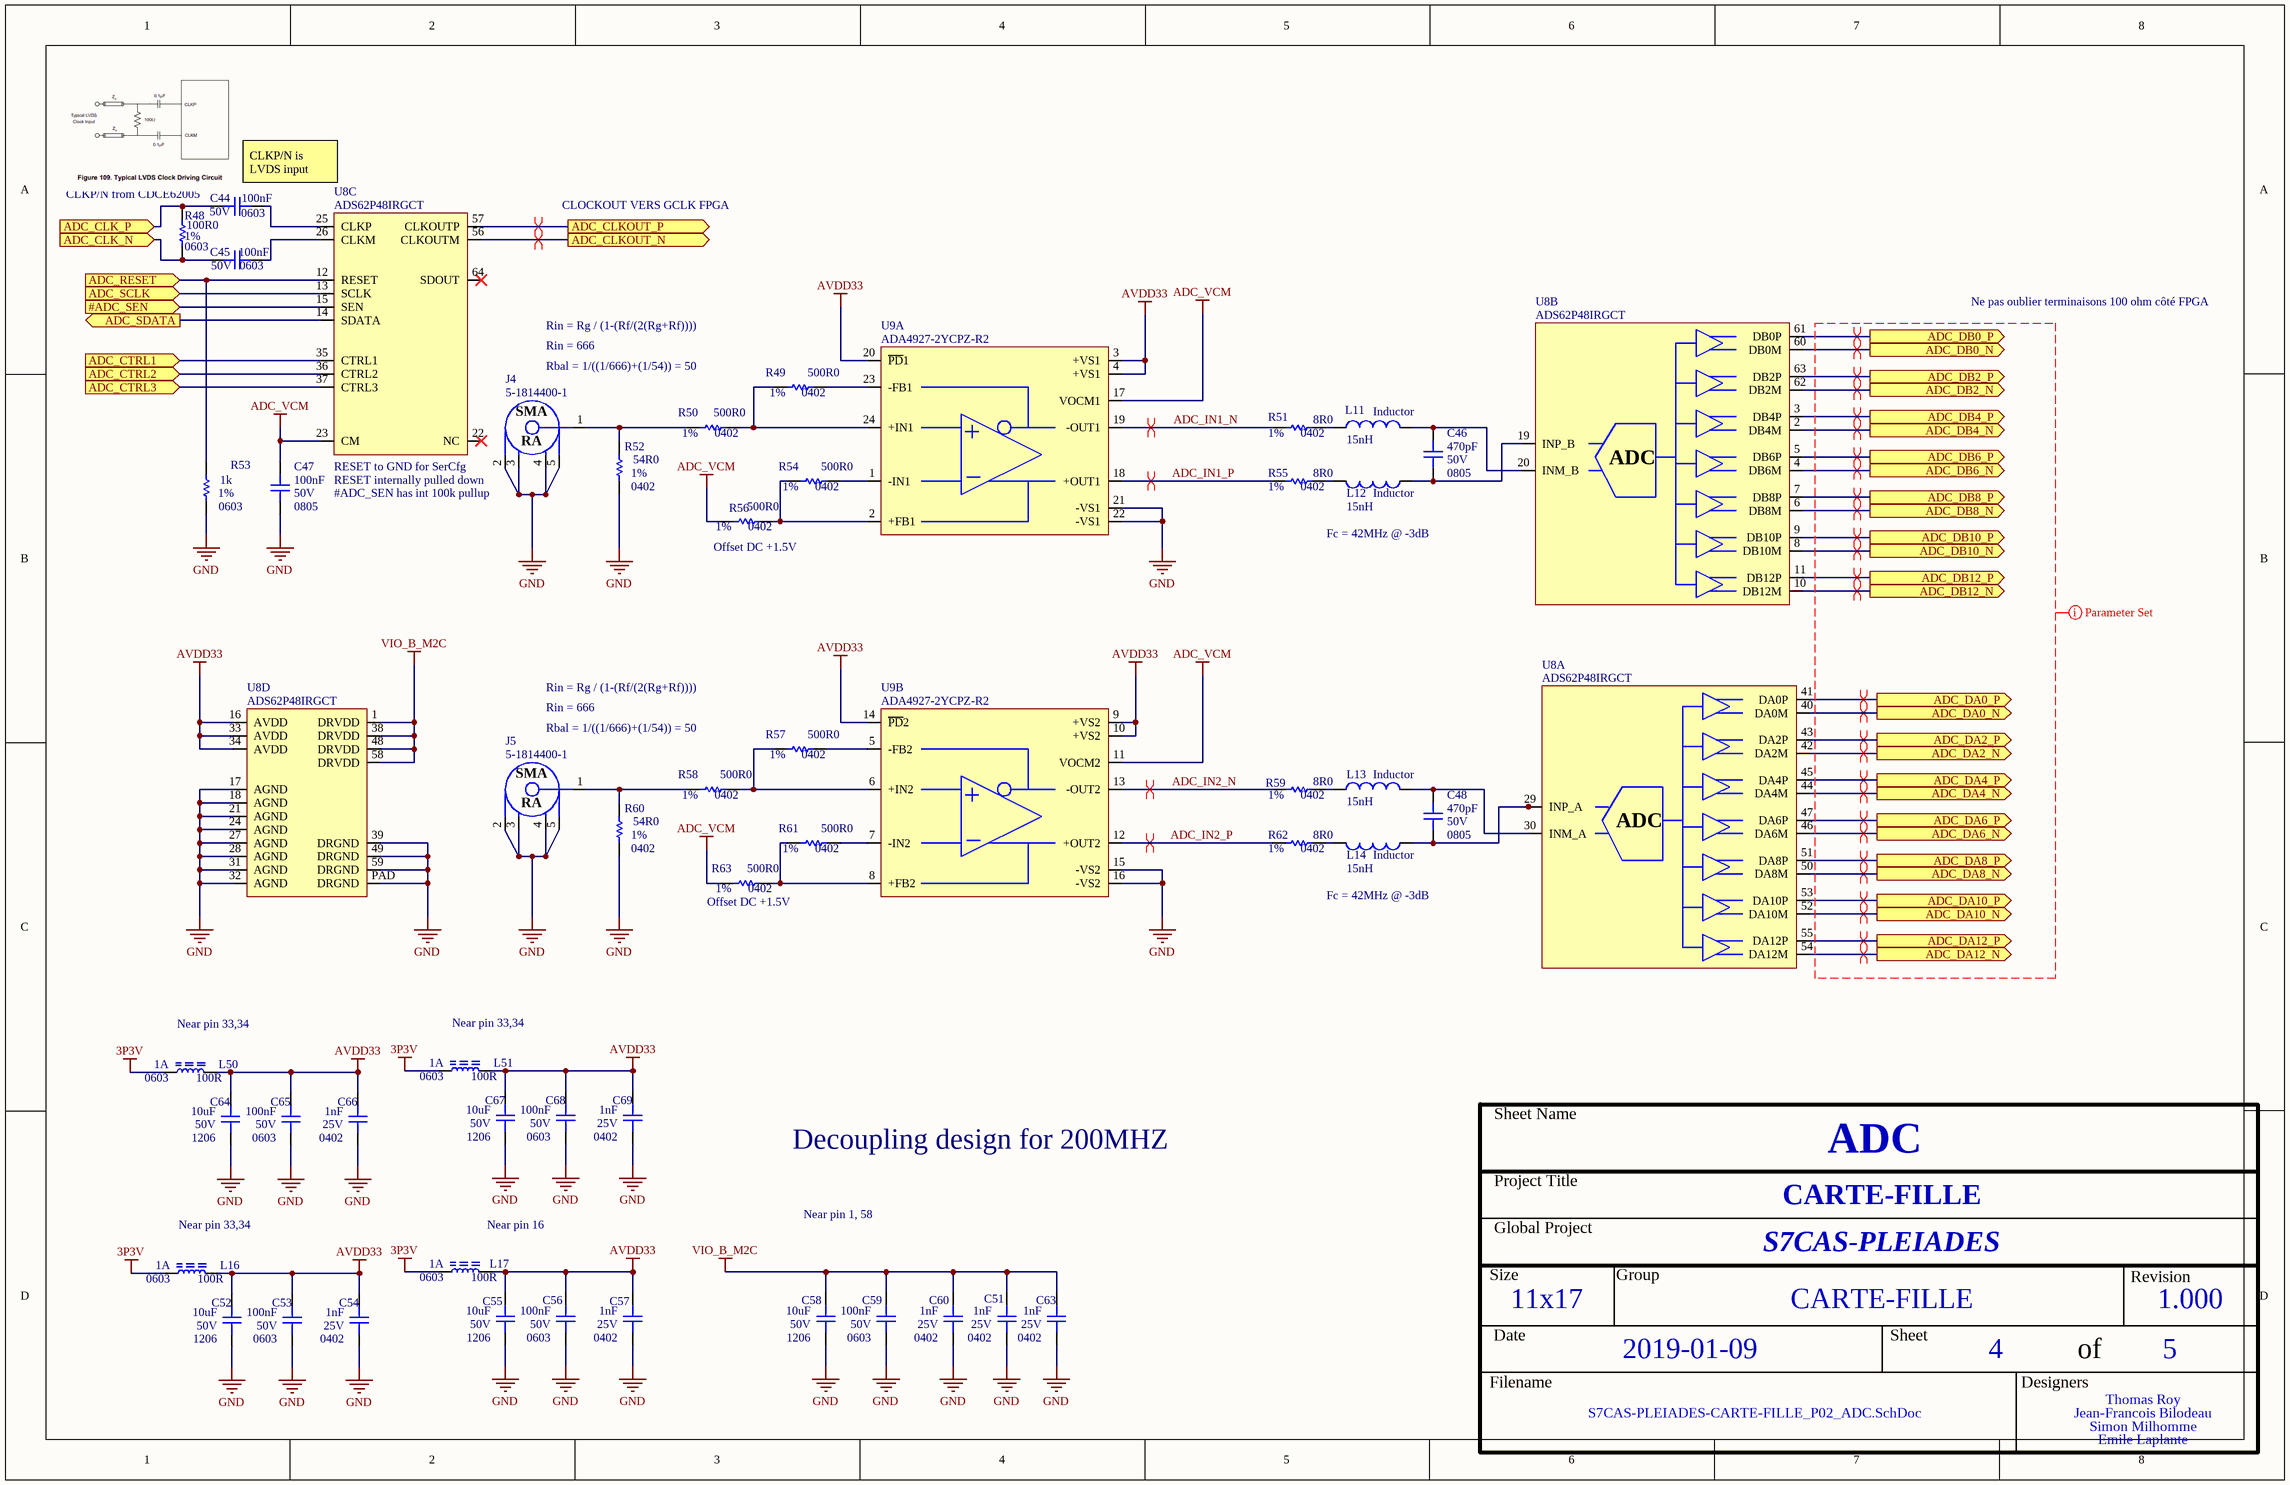
[diagram p3: S7CAS-PLEIADES-CARTE-FILLE_P02_ADC.SchDoc]

### Parts
C44  value 100nF  Voltage: 50V  Package: 0603  [CAP_0603]  (hidden comment: CAP - 0603)
C45  value 100nF  Voltage: 50V  Package: 0603  [CAP_0603]  (hidden comment: CAP - 0603)
C46  value 470pF  Voltage: 50V  Package: 0805  [CAP_0805]  (hidden comment: CAP - 0805)
C47  value 100nF  Voltage: 50V  Package: 0805  [CAP_0805]  (hidden comment: CAP - 0805)
C48  value 470pF  Voltage: 50V  Package: 0805  [CAP_0805]  (hidden comment: CAP - 0805)
C51  value 1nF  Voltage: 25V  Package: 0402  [CAP_0402]  (hidden comment: CAP - 0402)
C52  value 10uF  Voltage: 50V  Package: 1206  [CAP_1206]  (hidden comment: CAP - 1206)
C53  value 100nF  Voltage: 50V  Package: 0603  [CAP_0603]  (hidden comment: CAP - 0603)
C54  value 1nF  Voltage: 25V  Package: 0402  [CAP_0402]  (hidden comment: CAP - 0402)
C55  value 10uF  Voltage: 50V  Package: 1206  [CAP_1206]  (hidden comment: CAP - 1206)
C56  value 100nF  Voltage: 50V  Package: 0603  [CAP_0603]  (hidden comment: CAP - 0603)
C57  value 1nF  Voltage: 25V  Package: 0402  [CAP_0402]  (hidden comment: CAP - 0402)
C58  value 10uF  Voltage: 50V  Package: 1206  [CAP_1206]  (hidden comment: CAP - 1206)
C59  value 100nF  Voltage: 50V  Package: 0603  [CAP_0603]  (hidden comment: CAP - 0603)
C60  value 1nF  Voltage: 25V  Package: 0402  [CAP_0402]  (hidden comment: CAP - 0402)
C63  value 1nF  Voltage: 25V  Package: 0402  [CAP_0402]  (hidden comment: CAP - 0402)
C64  value 10uF  Voltage: 50V  Package: 1206  [CAP_1206]  (hidden comment: CAP - 1206)
C65  value 100nF  Voltage: 50V  Package: 0603  [CAP_0603]  (hidden comment: CAP - 0603)
C66  value 1nF  Voltage: 25V  Package: 0402  [CAP_0402]  (hidden comment: CAP - 0402)
C67  value 10uF  Voltage: 50V  Package: 1206  [CAP_1206]  (hidden comment: CAP - 1206)
C68  value 100nF  Voltage: 50V  Package: 0603  [CAP_0603]  (hidden comment: CAP - 0603)
C69  value 1nF  Voltage: 25V  Package: 0402  [CAP_0402]  (hidden comment: CAP - 0402)
J4  5-1814400-1  [CONN_SMA_5-1814400-1]
J5  5-1814400-1  [CONN_SMA_5-1814400-1]
L11  Inductor  value 15nH  [0402-A]
L12  Inductor  value 15nH  [0402-A]
L13  Inductor  value 15nH  [0402-A]
L14  Inductor  value 15nH  [0402-A]
L16  value 100R  Current: 1A  Package: 0603  [FER_0603]  (hidden comment: FER - 0603)
L17  value 100R  Current: 1A  Package: 0603  [FER_0603]  (hidden comment: FER - 0603)
L50  value 100R  Current: 1A  Package: 0603  [FER_0603]  (hidden comment: FER - 0603)
L51  value 100R  Current: 1A  Package: 0603  [FER_0603]  (hidden comment: FER - 0603)
R48  value 100R0  Package: 0603  Precision: 1%  [RES_0603]  (hidden comment: RES - 0603)
R49  value 500R0  Package: 0402  Precision: 1%  [RES_0402]  (hidden comment: RES - 0402)
R50  value 500R0  Package: 0402  Precision: 1%  [RES_0402]  (hidden comment: RES - 0402)
R51  value 8R0  Package: 0402  Precision: 1%  [RES_0402]  (hidden comment: RES - 0402)
R52  value 54R0  Package: 0402  Precision: 1%  [RES_0402]  (hidden comment: RES - 0402)
R53  value 1k  Package: 0603  Precision: 1%  [RES_0603]  (hidden comment: RES - 0603)
R54  value 500R0  Package: 0402  Precision: 1%  [RES_0402]  (hidden comment: RES - 0402)
R55  value 8R0  Package: 0402  Precision: 1%  [RES_0402]  (hidden comment: RES - 0402)
R56  value 500R0  Package: 0402  Precision: 1%  [RES_0402]  (hidden comment: RES - 0402)
R57  value 500R0  Package: 0402  Precision: 1%  [RES_0402]  (hidden comment: RES - 0402)
R58  value 500R0  Package: 0402  Precision: 1%  [RES_0402]  (hidden comment: RES - 0402)
R59  value 8R0  Package: 0402  Precision: 1%  [RES_0402]  (hidden comment: RES - 0402)
R60  value 54R0  Package: 0402  Precision: 1%  [RES_0402]  (hidden comment: RES - 0402)
R61  value 500R0  Package: 0402  Precision: 1%  [RES_0402]  (hidden comment: RES - 0402)
R62  value 8R0  Package: 0402  Precision: 1%  [RES_0402]  (hidden comment: RES - 0402)
R63  value 500R0  Package: 0402  Precision: 1%  [RES_0402]  (hidden comment: RES - 0402)
U8  ADS62P48IRGCT  [ADC_ADS62P48IRGCT]  (parts A,B,C,D of 4)
U9  ADA4927-2YCPZ-R2  [OPAMP_ADA4927-2YCPZ-R2]  (parts A,B of 2)

### Ports
#ADC_SEN (in), ADC_CLK_N (in), ADC_CLK_P (in), ADC_CLKOUT_N (out), ADC_CLKOUT_P (out), ADC_CTRL1 (in), ADC_CTRL2 (in), ADC_CTRL3 (in), ADC_DA0_N (out), ADC_DA0_P (out), ADC_DA2_N (out), ADC_DA2_P (out), ADC_DA4_N (out), ADC_DA4_P (out), ADC_DA6_N (out), ADC_DA6_P (out), ADC_DA8_N (out), ADC_DA8_P (out), ADC_DA10_N (out), ADC_DA10_P (out), ADC_DA12_N (out), ADC_DA12_P (out), ADC_DB0_N (out), ADC_DB0_P (out), ADC_DB2_N (out), ADC_DB2_P (out), ADC_DB4_N (out), ADC_DB4_P (out), ADC_DB6_N (out), ADC_DB6_P (out), ADC_DB8_N (out), ADC_DB8_P (out), ADC_DB10_N (out), ADC_DB10_P (out), ADC_DB12_N (out), ADC_DB12_P (out), ADC_RESET (in), ADC_SCLK (in), ADC_SDATA (out)

### Nets
3P3V: L16.1 L17.1 L50.1 L51.1
ADC_VCM: C47.2 R56.2 R63.2 U8.23(CM) U9.11(VOCM2) U9.17(VOCM1)
AVDD33: C52.2 C53.2 C54.2 C55.2 C56.2 C57.2 C64.2 C65.2 C66.2 C67.2 C68.2 C69.2 L16.2 L17.2 L50.2 L51.2 U8.16(AVDD) U8.33(AVDD) U8.34(AVDD) U9.3(+VS1) U9.4(+VS1) U9.9(+VS2) U9.10(+VS2) U9.14(~{PD}2) U9.20(~{PD}1)
GND: C47.1 C51.1 C52.1 C53.1 C54.1 C55.1 C56.1 C57.1 C58.1 C59.1 C60.1 C63.1 C64.1 C65.1 C66.1 C67.1 C68.1 C69.1 J4.2 J4.3 J4.4 J4.5 J5.2 J5.3 J5.4 J5.5 R52.1 R53.1 R60.1 U8.17(AGND) U8.18(AGND) U8.21(AGND) U8.24(AGND) U8.27(AGND) U8.28(AGND) U8.31(AGND) U8.32(AGND) U8.39(DRGND) U8.49(DRGND) U8.59(DRGND) U8.PAD(DRGND) U9.15(-VS2) U9.16(-VS2) U9.21(-VS1) U9.22(-VS1)
VIO_B_M2C: C51.2 C58.2 C59.2 C60.2 C63.2 U8.1(DRVDD) U8.38(DRVDD) U8.48(DRVDD) U8.58(DRVDD)
#ADC_SEN: U8.15(SEN) ; port #ADC_SEN
ADC_CLK_N: C45.2 R48.1 ; port ADC_CLK_N
ADC_CLK_P: C44.2 R48.2 ; port ADC_CLK_P
ADC_CLKOUT_N: U8.56(CLKOUTM) ; port ADC_CLKOUT_N
ADC_CLKOUT_P: U8.57(CLKOUTP) ; port ADC_CLKOUT_P
ADC_CTRL1: U8.35(CTRL1) ; port ADC_CTRL1
ADC_CTRL2: U8.36(CTRL2) ; port ADC_CTRL2
ADC_CTRL3: U8.37(CTRL3) ; port ADC_CTRL3
ADC_DA0_N: U8.40(DA0M) ; port ADC_DA0_N
ADC_DA0_P: U8.41(DA0P) ; port ADC_DA0_P
ADC_DA2_N: U8.42(DA2M) ; port ADC_DA2_N
ADC_DA2_P: U8.43(DA2P) ; port ADC_DA2_P
ADC_DA4_N: U8.44(DA4M) ; port ADC_DA4_N
ADC_DA4_P: U8.45(DA4P) ; port ADC_DA4_P
ADC_DA6_N: U8.46(DA6M) ; port ADC_DA6_N
ADC_DA6_P: U8.47(DA6P) ; port ADC_DA6_P
ADC_DA8_N: U8.50(DA8M) ; port ADC_DA8_N
ADC_DA8_P: U8.51(DA8P) ; port ADC_DA8_P
ADC_DA10_N: U8.52(DA10M) ; port ADC_DA10_N
ADC_DA10_P: U8.53(DA10P) ; port ADC_DA10_P
ADC_DA12_N: U8.54(DA12M) ; port ADC_DA12_N
ADC_DA12_P: U8.55(DA12P) ; port ADC_DA12_P
ADC_DB0_N: U8.60(DB0M) ; port ADC_DB0_N
ADC_DB0_P: U8.61(DB0P) ; port ADC_DB0_P
ADC_DB2_N: U8.62(DB2M) ; port ADC_DB2_N
ADC_DB2_P: U8.63(DB2P) ; port ADC_DB2_P
ADC_DB4_N: U8.2(DB4M) ; port ADC_DB4_N
ADC_DB4_P: U8.3(DB4P) ; port ADC_DB4_P
ADC_DB6_N: U8.4(DB6M) ; port ADC_DB6_N
ADC_DB6_P: U8.5(DB6P) ; port ADC_DB6_P
ADC_DB8_N: U8.6(DB8M) ; port ADC_DB8_N
ADC_DB8_P: U8.7(DB8P) ; port ADC_DB8_P
ADC_DB10_N: U8.8(DB10M) ; port ADC_DB10_N
ADC_DB10_P: U8.9(DB10P) ; port ADC_DB10_P
ADC_DB12_N: U8.10(DB12M) ; port ADC_DB12_N
ADC_DB12_P: U8.11(DB12P) ; port ADC_DB12_P
ADC_IN1_N: R51.2 U9.19(-OUT1)
ADC_IN1_P: R55.2 U9.18(+OUT1)
ADC_IN2_N: R59.2 U9.13(-OUT2)
ADC_IN2_P: R62.2 U9.12(+OUT2)
ADC_RESET: R53.2 U8.12(RESET) ; port ADC_RESET
ADC_SCLK: U8.13(SCLK) ; port ADC_SCLK
ADC_SDATA: U8.14(SDATA) ; port ADC_SDATA
NetC44_1: C44.1 U8.25(CLKP)
NetC45_1: C45.1 U8.26(CLKM)
NetC46_1: C46.1 L12.1 U8.19(INP_B)
NetC46_2: C46.2 L11.2 U8.20(INM_B)
NetC48_1: C48.1 L14.1 U8.29(INP_A)
NetC48_2: C48.2 L13.2 U8.30(INM_A)
NetJ4_1: J4.1 R50.2 R52.2
NetJ5_1: J5.1 R58.2 R60.2
NetL11_1: L11.1 R51.1
NetL12_2: L12.2 R55.1
NetL13_1: L13.1 R59.1
NetL14_2: L14.2 R62.1
NetR49_1: R49.1 U9.23(-FB1)
NetR49_2: R49.2 R50.1 U9.24(+IN1)
NetR54_1: R54.1 U9.1(-IN1)
NetR54_2: R54.2 R56.1 U9.2(+FB1)
NetR57_1: R57.1 U9.5(-FB2)
NetR57_2: R57.2 R58.1 U9.6(+IN2)
NetR61_1: R61.1 U9.7(-IN2)
NetR61_2: R61.2 R63.1 U9.8(+FB2)

Not connected (* = marked no-connect by the designer): U8 22(NC)* 64(SDOUT)*

### Layout directives
differential pair; differential pair class ADC_DIF: ADC_CLKOUT_N, ADC_CLKOUT_P, ADC_DA0_N, ADC_DA0_P, ADC_DA2_N, ADC_DA2_P, ADC_DA4_N, ADC_DA4_P, ADC_DA6_N, ADC_DA6_P, ADC_DA8_N, ADC_DA8_P, ADC_DA10_N, ADC_DA10_P, ADC_DA12_N, ADC_DA12_P, ADC_DB0_N, ADC_DB0_P, ADC_DB2_N, ADC_DB2_P, ADC_DB4_N, ADC_DB4_P, ADC_DB6_N, ADC_DB6_P, ADC_DB8_N, ADC_DB8_P, ADC_DB10_N, ADC_DB10_P, ADC_DB12_N, ADC_DB12_P, ADC_IN1_N, ADC_IN1_P, ADC_IN2_N, ADC_IN2_P
rule Differential Pairs Routing [Pref Gap = 10mil    Min Gap  = 10mil    Max Gap  = 10milPref Width = 15mil    Min Width  = 15mil    Max Width  = 15mil]: (no net found under the mark)

### Notes on the sheet
- (near R48) CLKP/N from CDCE62005
- (near C44) CLKP/N is LVDS input
- CLOCKOUT VERS GCLK FPGA
- Rin = Rg / (1-(Rf/(2(Rg+Rf))))
- Rin = 666
- (near U8) Ne pas oublier terminaisons 100 ohm côté FPGA
- Rbal = 1/((1/666)+(1/54)) = 50
- RESET to GND for SerCfg
- RESET internally pulled down
- #ADC_SEN has int 100k pullup
- (near R56) Offset DC +1.5V
- Fc = 42MHz @ -3dB
- (near R63) Offset DC +1.5V
- (near L50) Near pin 33,34
- (near L51) Near pin 33,34
- Decoupling design for 200MHZ
- (near L16) Near pin 33,34
- (near L17) Near pin 16
- Near pin 1, 58
- Sheet Name
- Project Title
- Global Project
- Size
- Group
- Revision
- Date
- Sheet
- of
- Filename
- Designers
- (in symbol ADC_ADS62P48IRGCT, part A) ADC
- (in symbol ADC_ADS62P48IRGCT, part B) ADC
- (in symbol CONN_SMA_5-1814400-1) SMA; RA

### Library data of the parts
C44 C45 C53 C56 C59 C65 C68 = CAP - 0603: Precision: 10%; Current: *; CreatedBy: Jonathan Bouchard; Power: *
C46-C48 = CAP - 0805: Precision: 10%; Current: *; CreatedBy: Jonathan Bouchard; Power: *
C51 C54 C57 C60 C63 C66 C69 = CAP - 0402: Precision: 10%; Current: *; CreatedBy: Jonathan Bouchard; Power: *
C52 C55 C58 C64 C67 = CAP - 1206: Precision: 10%; Current: *; CreatedBy: Jonathan Bouchard; Power: *
J4 J5 = CONN_SMA_5-1814400-1: CONN -  SMA JACK R/A 50 OHM - TH; Mfg: TE Connectivity AMP Connectors; Voltage: *; Current: *; Power: *; Mfg Part Number: 5-1814400-1; HelpURL: http://www.te.com/commerce/DocumentDelivery/DDEController?Action=srchrtrv&DocNm=1814400&DocType=Customer+Drawing&DocLang=English; CreatedBy: Jonathan Bouchard; Temperature: -55°C ~ 85°C; Value: *; Precision: *; Package: TH-5; Supplier 1: Digikey; Supplier Part Number 1: A97593-ND
L11-L14 = Inductor: Code_IEC: 1005; Published: 8-Jun-2000; LatestRevisionDate: 29-May-2009; LatestRevisionNote: IPC-7351 Footprint Added.; PackageReference: 0402-A; Publisher: Altium Limited; PackageDescription: Chip Inductor; Code_JEITA: 0402
R49-R52 R54-R63 = RES - 0402: Voltage: 50V; Power: 1/16W; Current: *; CreatedBy: Jonathan Bouchard
U8 = ADC_ADS62P48IRGCT: ADC - 14 BIT 210MSPS SUAL - VQFN-64; Voltage: 3.15 V ~ 3.6 V / 1.7 V ~ 1.9 V; Mfg: Texas Instruments; Precision: 14 Bit; Current: *; Power: *; Mfg Part Number: ADS62P48IRGCT; HelpURL: http://www.ti.com/lit/ds/symlink/ads62p48.pdf; CreatedBy: Jonathan Bouchard; Temperature: -40°C ~ 85°C; Value: *; Package: VQFN-64; Supplier 1: Digikey; Supplier Part Number 1: 296-24611-1-ND
U9 = OPAMP_ADA4927-2YCPZ-R2: OPAMP - CFA 2.3GHZ - QFN-24; Voltage: 4.5 V ~ 11 V, ±2.25 V ~ 5.5 V; Current: 65mA; Mfg: Analog Devices; Power: *; Mfg Part Number: ADA4927-2YCPZ-R2; HelpURL: http://www.analog.com/media/en/technical-documentation/data-sheets/ADA4927-1_4927-2.pdf; CreatedBy: Jonathan Bouchard; Temperature: -40°C ~ 105°C; Value: *; Precision: *; Package: QFN-24; Supplier 1: Digikey; Supplier Part Number 1: ADA4927-2YCPZ-R2CT-ND
L16 L17 L50 L51 = FER - 0603: Voltage: *; CreatedBy: Jonathan Bouchard; Power: *; Precision: *
R48 R53 = RES - 0603: Current: *; CreatedBy: Jonathan Bouchard

## Sheet S7CAS-PLEIADES-CARTE-FILLE_P02_DAC.SchDoc
size Tabloid; DocumentNumber: 5; SheetNumber: 5; SheetTotal: 5; Size: 11x17; Sheet_Name: DAC
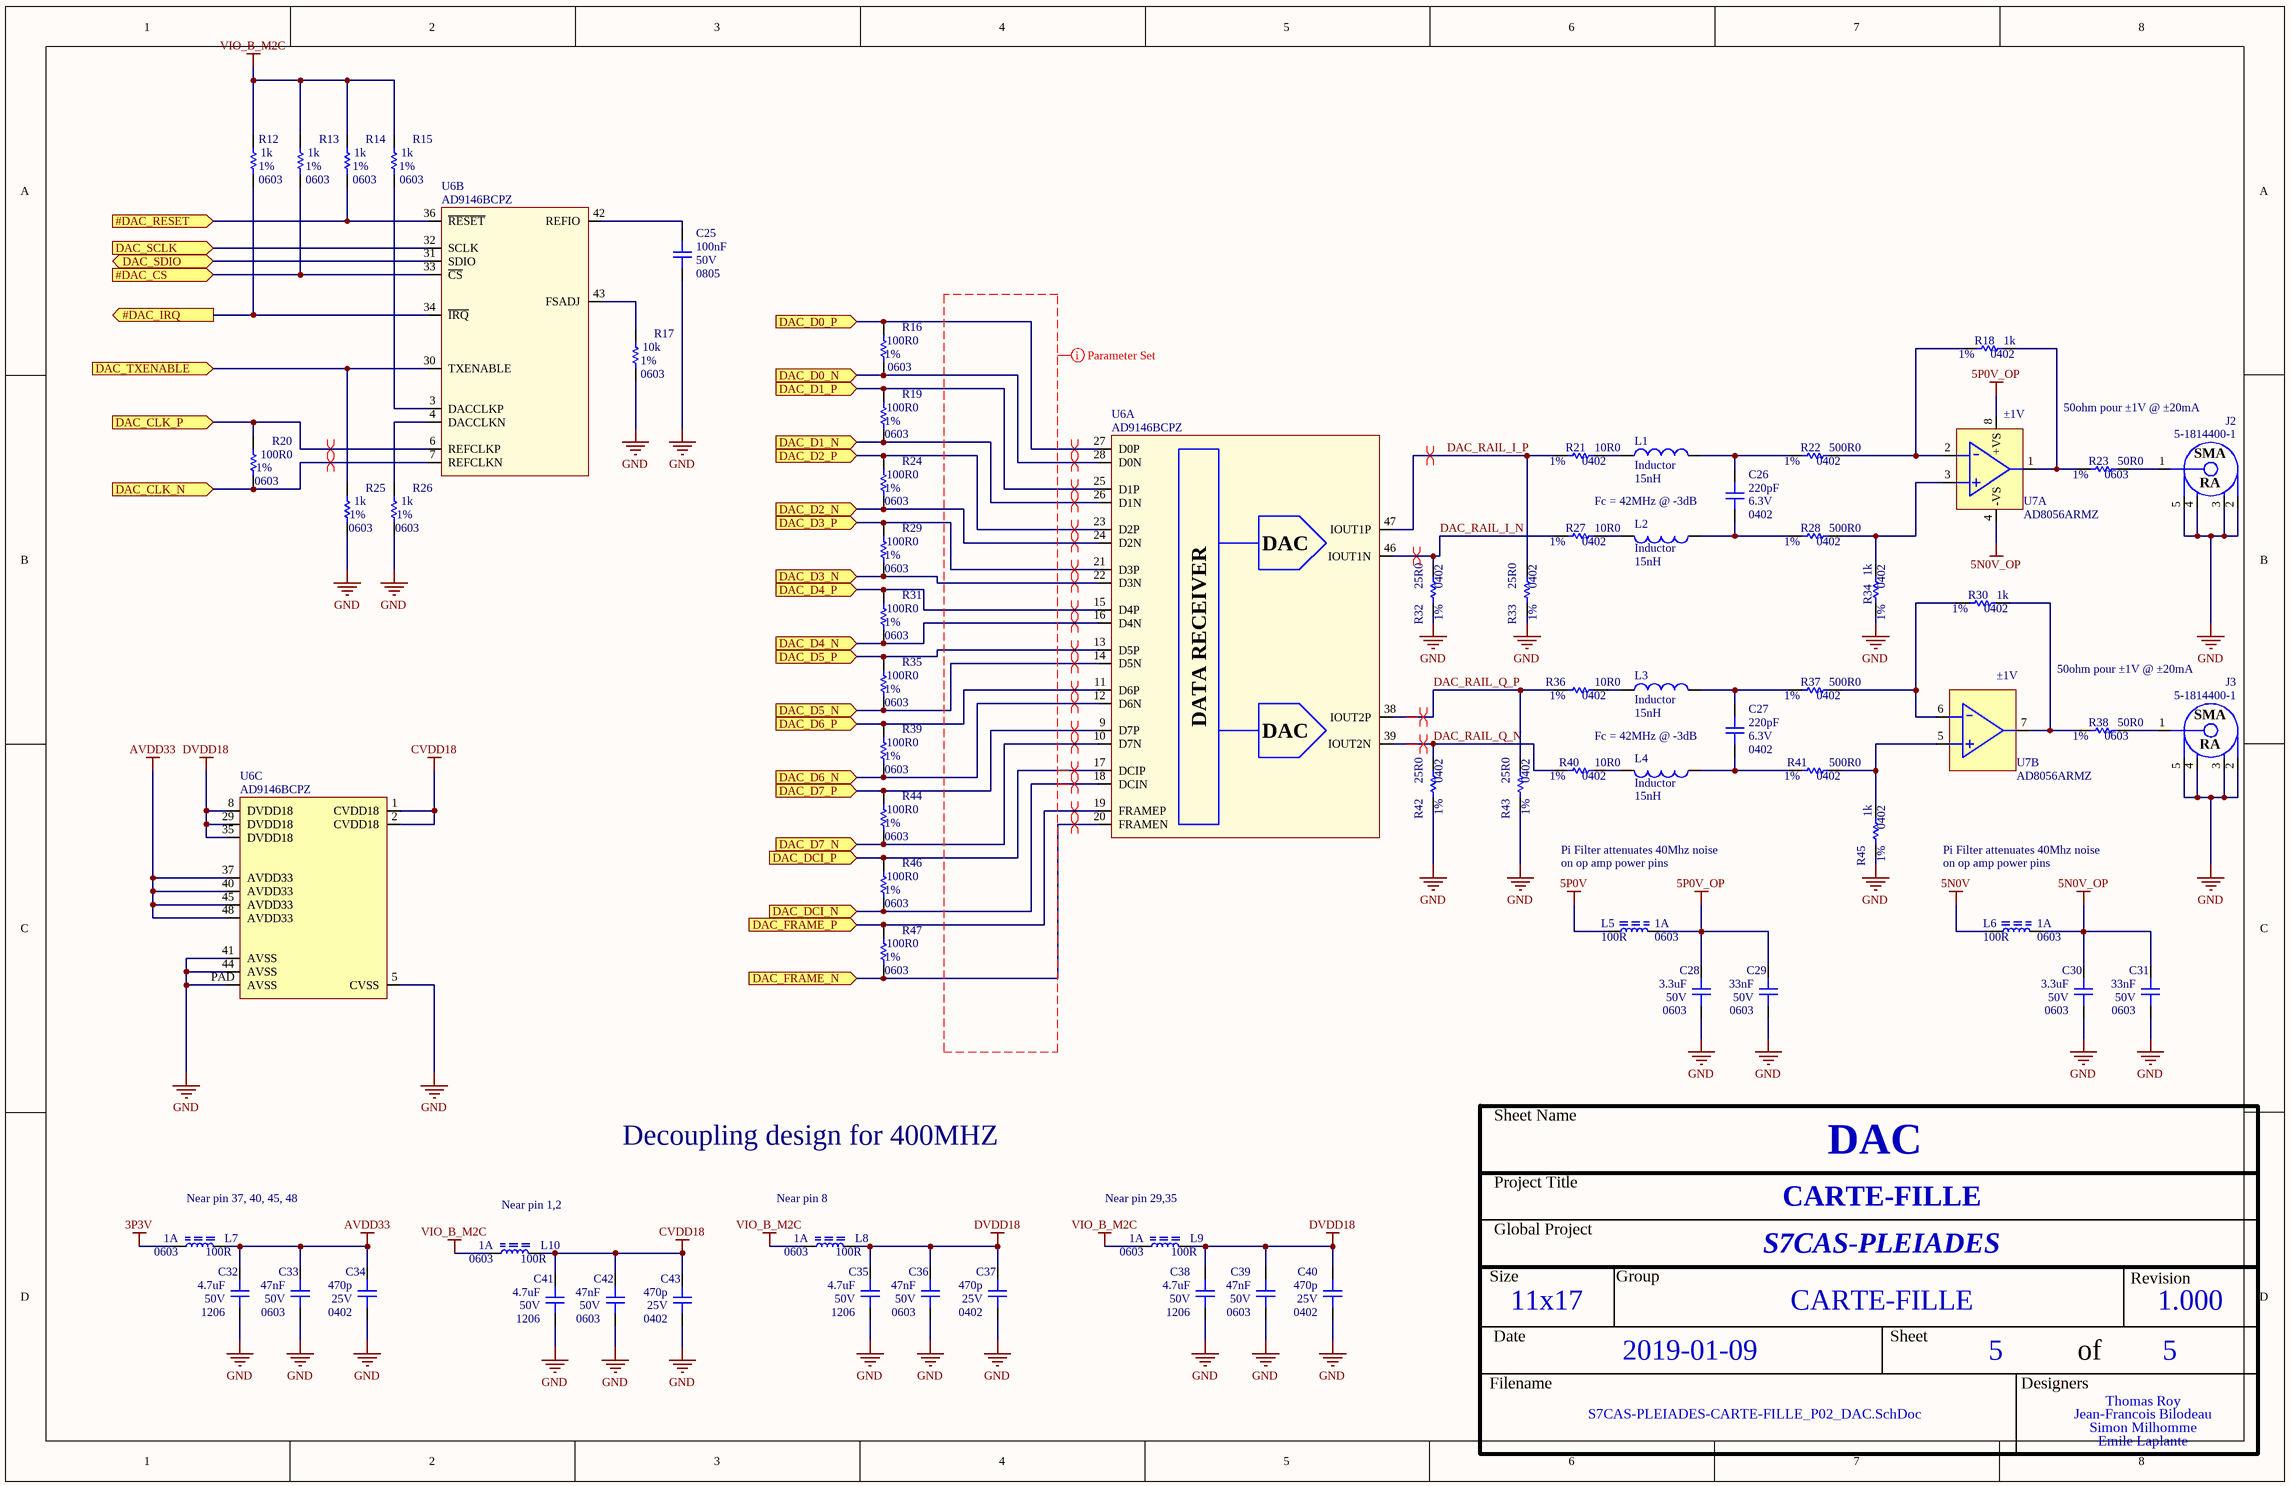
[diagram p4: S7CAS-PLEIADES-CARTE-FILLE_P02_DAC.SchDoc]

### Parts
C25  value 100nF  Voltage: 50V  Package: 0805  [CAP_0805]  (hidden comment: CAP - 0805)
C26  value 220pF  Voltage: 6.3V  Package: 0402  [CAP_0402]  (hidden comment: CAP - 0402)
C27  value 220pF  Voltage: 6.3V  Package: 0402  [CAP_0402]  (hidden comment: CAP - 0402)
C28  value 3.3uF  Voltage: 50V  Package: 0603  [CAP_0603]  (hidden comment: CAP - 0603)
C29  value 33nF  Voltage: 50V  Package: 0603  [CAP_0603]  (hidden comment: CAP - 0603)
C30  value 3.3uF  Voltage: 50V  Package: 0603  [CAP_0603]  (hidden comment: CAP - 0603)
C31  value 33nF  Voltage: 50V  Package: 0603  [CAP_0603]  (hidden comment: CAP - 0603)
C32  value 4.7uF  Voltage: 50V  Package: 1206  [CAP_1206]  (hidden comment: CAP - 1206)
C33  value 47nF  Voltage: 50V  Package: 0603  [CAP_0603]  (hidden comment: CAP - 0603)
C34  value 470p  Voltage: 25V  Package: 0402  [CAP_0402]  (hidden comment: CAP - 0402)
C35  value 4.7uF  Voltage: 50V  Package: 1206  [CAP_1206]  (hidden comment: CAP - 1206)
C36  value 47nF  Voltage: 50V  Package: 0603  [CAP_0603]  (hidden comment: CAP - 0603)
C37  value 470p  Voltage: 25V  Package: 0402  [CAP_0402]  (hidden comment: CAP - 0402)
C38  value 4.7uF  Voltage: 50V  Package: 1206  [CAP_1206]  (hidden comment: CAP - 1206)
C39  value 47nF  Voltage: 50V  Package: 0603  [CAP_0603]  (hidden comment: CAP - 0603)
C40  value 470p  Voltage: 25V  Package: 0402  [CAP_0402]  (hidden comment: CAP - 0402)
C41  value 4.7uF  Voltage: 50V  Package: 1206  [CAP_1206]  (hidden comment: CAP - 1206)
C42  value 47nF  Voltage: 50V  Package: 0603  [CAP_0603]  (hidden comment: CAP - 0603)
C43  value 470p  Voltage: 25V  Package: 0402  [CAP_0402]  (hidden comment: CAP - 0402)
J2  5-1814400-1  [CONN_SMA_5-1814400-1]
J3  5-1814400-1  [CONN_SMA_5-1814400-1]
L1  Inductor  value 15nH  [0603]
L2  Inductor  value 15nH  [0603]
L3  Inductor  value 15nH  [0603]
L4  Inductor  value 15nH  [0603]
L5  value 100R  Current: 1A  Package: 0603  [FER_0603]  (hidden comment: FER - 0603)
L6  value 100R  Current: 1A  Package: 0603  [FER_0603]  (hidden comment: FER - 0603)
L7  value 100R  Current: 1A  Package: 0603  [FER_0603]  (hidden comment: FER - 0603)
L8  value 100R  Current: 1A  Package: 0603  [FER_0603]  (hidden comment: FER - 0603)
L9  value 100R  Current: 1A  Package: 0603  [FER_0603]  (hidden comment: FER - 0603)
L10  value 100R  Current: 1A  Package: 0603  [FER_0603]  (hidden comment: FER - 0603)
R12  value 1k  Package: 0603  Precision: 1%  [RES_0603]  (hidden comment: RES - 0603)
R13  value 1k  Package: 0603  Precision: 1%  [RES_0603]  (hidden comment: RES - 0603)
R14  value 1k  Package: 0603  Precision: 1%  [RES_0603]  (hidden comment: RES - 0603)
R15  value 1k  Package: 0603  Precision: 1%  [RES_0603]  (hidden comment: RES - 0603)
R16  value 100R0  Package: 0603  Precision: 1%  [RES_0603]  (hidden comment: RES - 0603)
R17  value 10k  Package: 0603  Precision: 1%  [RES_0603]  (hidden comment: RES - 0603)
R18  value 1k  Package: 0402  Precision: 1%  [RES_0402]  (hidden comment: RES - 0402)
R19  value 100R0  Package: 0603  Precision: 1%  [RES_0603]  (hidden comment: RES - 0603)
R20  value 100R0  Package: 0603  Precision: 1%  [RES_0603]  (hidden comment: RES - 0603)
R21  value 10R0  Package: 0402  Precision: 1%  [RES_0402]  (hidden comment: RES - 0402)
R22  value 500R0  Package: 0402  Precision: 1%  [RES_0402]  (hidden comment: RES - 0402)
R23  value 50R0  Package: 0603  Precision: 1%  [RES_0402]  (hidden comment: RES - 0402)
R24  value 100R0  Package: 0603  Precision: 1%  [RES_0603]  (hidden comment: RES - 0603)
R25  value 1k  Package: 0603  Precision: 1%  [RES_0603]  (hidden comment: RES - 0603)
R26  value 1k  Package: 0603  Precision: 1%  [RES_0603]  (hidden comment: RES - 0603)
R27  value 10R0  Package: 0402  Precision: 1%  [RES_0402]  (hidden comment: RES - 0402)
R28  value 500R0  Package: 0402  Precision: 1%  [RES_0402]  (hidden comment: RES - 0402)
R29  value 100R0  Package: 0603  Precision: 1%  [RES_0603]  (hidden comment: RES - 0603)
R30  value 1k  Package: 0402  Precision: 1%  [RES_0402]  (hidden comment: RES - 0402)
R31  value 100R0  Package: 0603  Precision: 1%  [RES_0603]  (hidden comment: RES - 0603)
R32  value 25R0  Package: 0402  Precision: 1%  [RES_0402]  (hidden comment: RES - 0402)
R33  value 25R0  Package: 0402  Precision: 1%  [RES_0402]  (hidden comment: RES - 0402)
R34  value 1k  Package: 0402  Precision: 1%  [RES_0402]  (hidden comment: RES - 0402)
R35  value 100R0  Package: 0603  Precision: 1%  [RES_0603]  (hidden comment: RES - 0603)
R36  value 10R0  Package: 0402  Precision: 1%  [RES_0402]  (hidden comment: RES - 0402)
R37  value 500R0  Package: 0402  Precision: 1%  [RES_0402]  (hidden comment: RES - 0402)
R38  value 50R0  Package: 0603  Precision: 1%  [RES_0402]  (hidden comment: RES - 0402)
R39  value 100R0  Package: 0603  Precision: 1%  [RES_0603]  (hidden comment: RES - 0603)
R40  value 10R0  Package: 0402  Precision: 1%  [RES_0402]  (hidden comment: RES - 0402)
R41  value 500R0  Package: 0402  Precision: 1%  [RES_0402]  (hidden comment: RES - 0402)
R42  value 25R0  Package: 0402  Precision: 1%  [RES_0402]  (hidden comment: RES - 0402)
R43  value 25R0  Package: 0402  Precision: 1%  [RES_0402]  (hidden comment: RES - 0402)
R44  value 100R0  Package: 0603  Precision: 1%  [RES_0603]  (hidden comment: RES - 0603)
R45  value 1k  Package: 0402  Precision: 1%  [RES_0402]  (hidden comment: RES - 0402)
R46  value 100R0  Package: 0603  Precision: 1%  [RES_0603]  (hidden comment: RES - 0603)
R47  value 100R0  Package: 0603  Precision: 1%  [RES_0603]  (hidden comment: RES - 0603)
U6  AD9146BCPZ  [DAC_AD9146BCPZ]  (parts A,B,C of 3)
U7  AD8056ARMZ  [OPAMP_AD8056ARMZ]  (parts A,B of 2)

### Ports
#DAC_CS (in), #DAC_IRQ (out), #DAC_RESET (in), DAC_CLK_N (in), DAC_CLK_P (in), DAC_D0_N (in), DAC_D0_P (in), DAC_D1_N (in), DAC_D1_P (in), DAC_D2_N (in), DAC_D2_P (in), DAC_D3_N (in), DAC_D3_P (in), DAC_D4_N (in), DAC_D4_P (in), DAC_D5_N (in), DAC_D5_P (in), DAC_D6_N (in), DAC_D6_P (in), DAC_D7_N (in), DAC_D7_P (in), DAC_DCI_N (in), DAC_DCI_P (in), DAC_FRAME_N (in), DAC_FRAME_P (in), DAC_SCLK (in), DAC_SDIO (bidir), DAC_TXENABLE (in)

### Nets
3P3V: L7.1
5N0V: L6.2
5N0V_OP: C30.2 C31.2 L6.1 U7.4(-VS)
5P0V: L5.2
5P0V_OP: C28.2 C29.2 L5.1 U7.8(+VS)
AVDD33: C32.2 C33.2 C34.2 L7.2 U6.37(AVDD33) U6.40(AVDD33) U6.45(AVDD33) U6.48(AVDD33)
CVDD18: C41.2 C42.2 C43.2 L10.2 U6.1(CVDD18) U6.2(CVDD18)
DVDD18: C35.2 C36.2 C37.2 C38.2 C39.2 C40.2 L8.2 L9.2 U6.8(DVDD18) U6.29(DVDD18) U6.35(DVDD18)
GND: C25.1 C28.1 C29.1 C30.1 C31.1 C32.1 C33.1 C34.1 C35.1 C36.1 C37.1 C38.1 C39.1 C40.1 C41.1 C42.1 C43.1 J2.2 J2.3 J2.4 J2.5 J3.2 J3.3 J3.4 J3.5 R17.1 R25.1 R26.1 R32.2 R33.2 R34.2 R42.2 R43.2 R45.2 U6.5(CVSS) U6.41(AVSS) U6.44(AVSS) U6.PAD(AVSS)
VIO_B_M2C: L8.1 L9.1 L10.1 R12.2 R13.2 R14.2 R15.2
#DAC_CS: R13.1 U6.33(~{CS}) ; port #DAC_CS
#DAC_IRQ: R12.1 U6.34(~{IRQ}) ; port #DAC_IRQ
#DAC_RESET: R14.1 U6.36(~{RESET}) ; port #DAC_RESET
DAC_CLK_N: R20.1 U6.7(REFCLKN) ; port DAC_CLK_N
DAC_CLK_P: R20.2 U6.6(REFCLKP) ; port DAC_CLK_P
DAC_D0_N: R16.1 U6.28(D0N) ; port DAC_D0_N
DAC_D0_P: R16.2 U6.27(D0P) ; port DAC_D0_P
DAC_D1_N: R19.1 U6.26(D1N) ; port DAC_D1_N
DAC_D1_P: R19.2 U6.25(D1P) ; port DAC_D1_P
DAC_D2_N: R24.1 U6.24(D2N) ; port DAC_D2_N
DAC_D2_P: R24.2 U6.23(D2P) ; port DAC_D2_P
DAC_D3_N: R29.1 U6.22(D3N) ; port DAC_D3_N
DAC_D3_P: R29.2 U6.21(D3P) ; port DAC_D3_P
DAC_D4_N: R31.1 U6.16(D4N) ; port DAC_D4_N
DAC_D4_P: R31.2 U6.15(D4P) ; port DAC_D4_P
DAC_D5_N: R35.1 U6.14(D5N) ; port DAC_D5_N
DAC_D5_P: R35.2 U6.13(D5P) ; port DAC_D5_P
DAC_D6_N: R39.1 U6.12(D6N) ; port DAC_D6_N
DAC_D6_P: R39.2 U6.11(D6P) ; port DAC_D6_P
DAC_D7_N: R44.1 U6.10(D7N) ; port DAC_D7_N
DAC_D7_P: R44.2 U6.9(D7P) ; port DAC_D7_P
DAC_DCI_N: R46.1 U6.18(DCIN) ; port DAC_DCI_N
DAC_DCI_P: R46.2 U6.17(DCIP) ; port DAC_DCI_P
DAC_FRAME_N: R47.1 U6.20(FRAMEN) ; port DAC_FRAME_N
DAC_FRAME_P: R47.2 U6.19(FRAMEP) ; port DAC_FRAME_P
DAC_RAIL_I_N: R27.2 R32.1 U6.46(IOUT1N)
DAC_RAIL_I_P: R21.2 R33.1 U6.47(IOUT1P)
DAC_RAIL_Q_N: R40.2 R42.1 U6.39(IOUT2N)
DAC_RAIL_Q_P: R36.2 R43.1 U6.38(IOUT2P)
DAC_SCLK: U6.32(SCLK) ; port DAC_SCLK
DAC_SDIO: U6.31(SDIO) ; port DAC_SDIO
DAC_TXENABLE: R25.2 U6.30(TXENABLE) ; port DAC_TXENABLE
NetC25_2: C25.2 U6.42(REFIO)
NetC26_1: C26.1 L2.1 R28.2
NetC26_2: C26.2 L1.2 R22.2
NetC27_1: C27.1 L4.1 R41.2
NetC27_2: C27.2 L3.2 R37.2
NetJ2_1: J2.1 R23.1
NetJ3_1: J3.1 R38.1
NetL1_1: L1.1 R21.1
NetL2_2: L2.2 R27.1
NetL3_1: L3.1 R36.1
NetL4_2: L4.2 R40.1
NetR15_1: R15.1 U6.3(DACCLKP)
NetR17_2: R17.2 U6.43(FSADJ)
NetR18_1: R18.1 R23.2 U7.1(OUT1)
NetR18_2: R18.2 R22.1 U7.2(-IN1)
NetR26_2: R26.2 U6.4(DACCLKN)
NetR28_1: R28.1 R34.1 U7.3(+IN1)
NetR30_1: R30.1 R38.2 U7.7(OUT2)
NetR30_2: R30.2 R37.1 U7.6(-IN2)
NetR41_1: R41.1 R45.1 U7.5(+IN2)

### Layout directives
differential pair; differential pair class DAC_DIF: DAC_CLK_N, DAC_CLK_P, DAC_D0_N, DAC_D0_P, DAC_D1_N, DAC_D1_P, DAC_D2_N, DAC_D2_P, DAC_D3_N, DAC_D3_P, DAC_D4_N, DAC_D4_P, DAC_D5_N, DAC_D5_P, DAC_D6_N, DAC_D6_P, DAC_D7_N, DAC_D7_P, DAC_RAIL_I_N, DAC_RAIL_I_P, DAC_RAIL_Q_N, DAC_RAIL_Q_P
differential pair; differential pair class DAC_DIF; net class DIFF100: DAC_DCI_N, DAC_DCI_P, DAC_FRAME_N, DAC_FRAME_P
rule Differential Pairs Routing [Pref Gap = 10mil    Min Gap  = 10mil    Max Gap  = 10milPref Width = 15mil    Min Width  = 15mil    Max Width  = 15mil]: (no net found under the mark)

### Notes on the sheet
- (near U7) ±1V
- 50ohm pour ±1V @ ±20mA
- Fc = 42MHz @ -3dB
- Pi Filter attenuates 40Mhz noise
- on op amp power pins
- Decoupling design for 400MHZ
- (near L7) Near pin 37, 40, 45, 48
- (near L10) Near pin 1,2
- (near L8) Near pin 8
- (near L9) Near pin 29,35
- Sheet Name
- Project Title
- Global Project
- Size
- Group
- Revision
- Date
- Sheet
- of
- Filename
- Designers
- (in symbol CONN_SMA_5-1814400-1) SMA; RA
- (in symbol DAC_AD9146BCPZ, part A) DAC; DATA RECEIVER

### Library data of the parts
C25 = CAP - 0805: Precision: 10%; Current: *; CreatedBy: Jonathan Bouchard; Power: *
C26 C27 = CAP - 0402: Mfg Part Number: GRM022R60J104KE15; Mfg: Murata; Precision: 10%; Current: *; CreatedBy: Jonathan Bouchard; Power: *
C28-C31 C33 C36 C39 C42 = CAP - 0603: Precision: 10%; Current: *; CreatedBy: Jonathan Bouchard; Power: *
C32 C35 C38 C41 = CAP - 1206: Precision: 10%; Current: *; CreatedBy: Jonathan Bouchard; Power: *
C34 C37 C40 C43 = CAP - 0402: Precision: 10%; Current: *; CreatedBy: Jonathan Bouchard; Power: *
J2 J3 = CONN_SMA_5-1814400-1: as J4 on sheet S7CAS-PLEIADES-CARTE-FILLE_P02_ADC; Voltage: *; Current: *; Power: *; Mfg Part Number: 5-1814400-1; HelpURL: http://www.te.com/commerce/DocumentDelivery/DDEController?Action=srchrtrv&DocNm=1814400&DocType=Customer+Drawing&DocLang=English; CreatedBy: Jonathan Bouchard; Temperature: -55°C ~ 85°C; Value: *; Precision: *; Package: TH-5; Supplier 1: Digikey; Supplier Part Number 1: A97593-ND
L1-L4 = Inductor: Code_IEC: 1005; Published: 8-Jun-2000; LatestRevisionDate: 29-May-2009; LatestRevisionNote: IPC-7351 Footprint Added.; PackageReference: 0402-A; Publisher: Altium Limited; PackageDescription: Chip Inductor; Code_JEITA: 0402
R18 R21-R23 R27 R28 R30 R32-R34 R36-R38 R40-R43 R45 = RES - 0402: Voltage: 50V; Power: 1/16W; Current: *; CreatedBy: Jonathan Bouchard
U6 = DAC_AD9146BCPZ: DAC - 16BIT SRL HIGH SPEED - QFN-48; Voltage: 3.13 V ~ 3.47 V / 1.71 V ~ 1.89 V; Mfg: Analog Devices Inc.; Current: *; Power: *; Mfg Part Number: AD9146BCPZ; HelpURL: http://www.analog.com/media/en/technical-documentation/data-sheets/AD9146.PDF; CreatedBy: Jonathan Bouchard; Temperature: -40°C ~ 85°C; Value: *; Precision: 16 Bit; Package: QFN-48; Supplier 1: Digikey; Supplier Part Number 1: AD9146BCPZ-ND
U7 = OPAMP_AD8056ARMZ: OPAMP - VFB 300MHZ - 8MSOP; Voltage: 8 V ~ 12 V, ±4 V ~ 6 V; Current: 60mA; Mfg: Analog Devices; Power: *; Mfg Part Number: AD8056ARMZ; HelpURL: http://www.analog.com/media/en/technical-documentation/data-sheets/AD8055_8056.pdf; CreatedBy: Jonathan Bouchard; Temperature: -40°C ~ 125°C; Value: *; Precision: *; Package: MSOP-8; Supplier 1: Digikey; Supplier Part Number 1: AD8056ARMZ-REEL7CT-ND
L5-L10 = FER - 0603: Voltage: *; CreatedBy: Jonathan Bouchard; Power: *; Precision: *
R12-R17 R19 R20 R24-R26 R29 R31 R35 R39 R44 R46 R47 = RES - 0603: Current: *; CreatedBy: Jonathan Bouchard